# EAGLE design trill-hex (EAGLE 6.5.0)
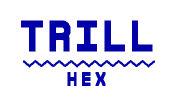
[diagram p0: schematic, sheet 1, part 1 of 2]
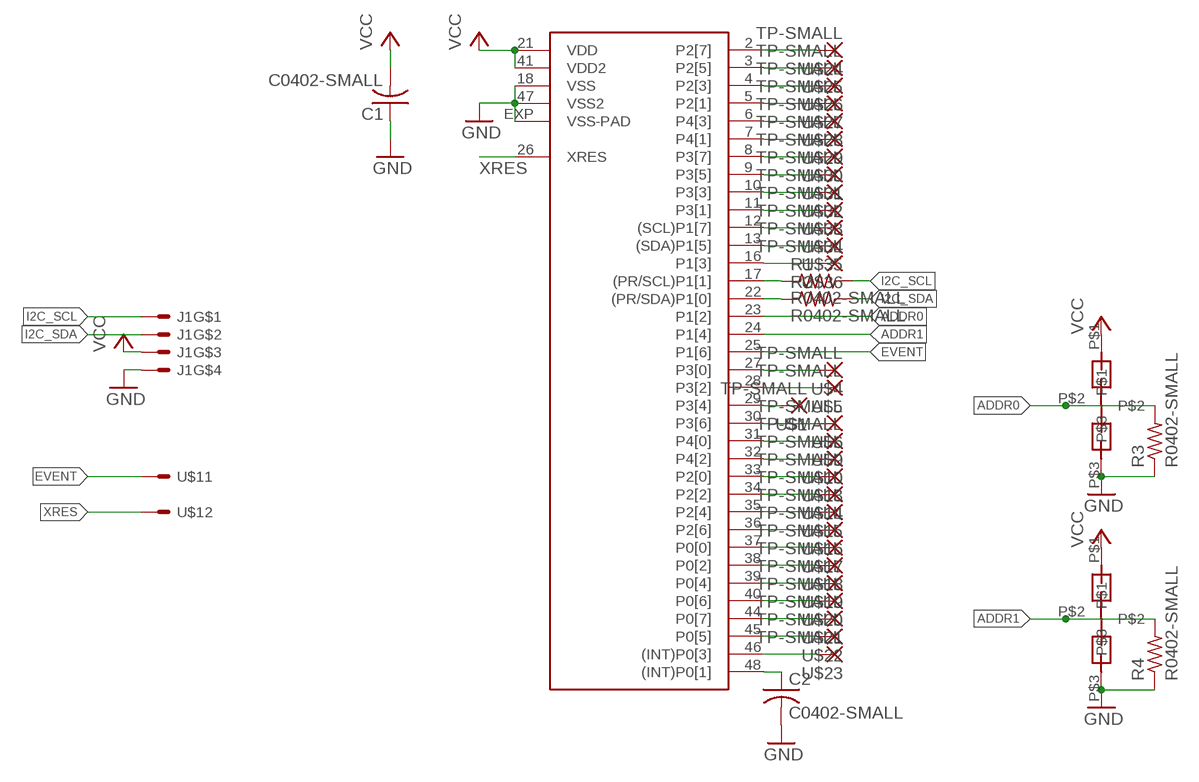
[diagram p1: schematic, sheet 1, part 2 of 2]

## Parts
C1  C0402-SMALL  [C0402-SMALL]
C2  C0402-SMALL  [C0402-SMALL]
IC1  CY8C206X6A  [QFN48-LEADS]
J1  GROVE-SMT  [JST-PH-4-SMT]
R1  R0402-SMALL  [C0402-SMALL]
R2  R0402-SMALL  [C0402-SMALL]
R3  R0402-SMALL  [C0402-SMALL]
R4  R0402-SMALL  [C0402-SMALL]
U$1  TP-SMALL  [TESTPAD-SMALL]
U$4  TP-SMALL  [TESTPAD-SMALL]
U$5  TP-SMALL  [TESTPAD-SMALL]
U$6  TP-SMALL  [TESTPAD-SMALL]
U$7  SOLDER_JUMPER_3PAD  [SOLDER_JUMPER_3PAD]
U$8  SOLDER_JUMPER_3PAD  [SOLDER_JUMPER_3PAD]
U$9  TP-SMALL  [TESTPAD-SMALL]
U$10  TP-SMALL  [TESTPAD-SMALL]
U$11  JST-SMT-EXTRAPAD  [JST-SMT-EXTRAPAD]
U$12  JST-SMT-EXTRAPAD  [JST-SMT-EXTRAPAD]
U$13  TP-SMALL  [TESTPAD-SMALL]
U$14  TP-SMALL  [TESTPAD-SMALL]
U$15  TP-SMALL  [TESTPAD-SMALL]
U$16  TP-SMALL  [TESTPAD-SMALL]
U$17  TP-SMALL  [TESTPAD-SMALL]
U$18  TP-SMALL  [TESTPAD-SMALL]
U$19  TP-SMALL  [TESTPAD-SMALL]
U$20  TP-SMALL  [TESTPAD-SMALL]
U$21  TP-SMALL  [TESTPAD-SMALL]
U$22  TP-SMALL  [TESTPAD-SMALL]
U$23  TP-SMALL  [TESTPAD-SMALL]
U$24  TP-SMALL  [TESTPAD-SMALL]
U$25  TP-SMALL  [TESTPAD-SMALL]
U$26  TP-SMALL  [TESTPAD-SMALL]
U$27  TP-SMALL  [TESTPAD-SMALL]
U$28  TP-SMALL  [TESTPAD-SMALL]
U$29  TP-SMALL  [TESTPAD-SMALL]
U$30  TP-SMALL  [TESTPAD-SMALL]
U$31  TP-SMALL  [TESTPAD-SMALL]
U$32  TP-SMALL  [TESTPAD-SMALL]
U$33  TP-SMALL  [TESTPAD-SMALL]
U$34  TP-SMALL  [TESTPAD-SMALL]
U$35  TP-SMALL  [TESTPAD-SMALL]
U$36  TP-SMALL  [TESTPAD-SMALL]

## Nets
ADDR0: IC1.23(P1[2]) R3.P$2 U$7.P$2
ADDR1: IC1.24(P1[4]) R4.P$2 U$8.P$2
COL1: IC1.27(P3[0]) U$4.P$1(P)
COL2: IC1.28(P3[2]) U$5.P$1(P)
COL3: IC1.29(P3[4]) U$1.P$1(P)
COL4: IC1.30(P3[6]) U$6.P$1(P)
COL5: IC1.31(P4[0]) U$9.P$1(P)
COL6: IC1.32(P4[2]) U$10.P$1(P)
COL7: IC1.33(P2[0]) U$13.P$1(P)
COL8: IC1.13((SDA)P1[5]) U$35.P$1(P)
COL9: IC1.44(P0[7]) U$21.P$1(P)
COL10: IC1.45(P0[5]) U$22.P$1(P)
COL11: IC1.3(P2[5]) U$25.P$1(P)
COL12: IC1.4(P2[3]) U$26.P$1(P)
COL13: IC1.5(P2[1]) U$27.P$1(P)
COL14: IC1.6(P4[3]) U$28.P$1(P)
EVENT: IC1.25(P1[6]) U$11.P$1(S)
GND: C1.P$1 C2.P$2 IC1.18(VSS) IC1.47(VSS2) IC1.EXP(VSS-PAD) J1.4 R3.P$1 R4.P$1 U$7.P$3 U$8.P$3
I2C_SCL: J1.1 R1.P$2
I2C_SDA: J1.2 R2.P$2
N$3: C2.P$1 IC1.48((INT)P0[1])
N$71Z1Z1O1K1: IC1.17((PR/SCL)P1[1]) R1.P$1
N$72Z1Z1O1K1: IC1.22((PR/SDA)P1[0]) R2.P$1
ROW1: IC1.16(P1[3]) U$36.P$1(P)
ROW2: IC1.12((SCL)P1[7]) U$34.P$1(P)
ROW3: IC1.11(P3[1]) U$33.P$1(P)
ROW4: IC1.10(P3[3]) U$32.P$1(P)
ROW5: IC1.9(P3[5]) U$31.P$1(P)
ROW6: IC1.8(P3[7]) U$30.P$1(P)
ROW7: IC1.7(P4[1]) U$29.P$1(P)
ROW8: IC1.2(P2[7]) U$24.P$1(P)
ROW9: IC1.46((INT)P0[3]) U$23.P$1(P)
ROW10: IC1.34(P2[2]) U$14.P$1(P)
ROW11: IC1.35(P2[4]) U$15.P$1(P)
ROW12: IC1.36(P2[6]) U$16.P$1(P)
ROW13: IC1.37(P0[0]) U$17.P$1(P)
ROW14: IC1.38(P0[2]) U$18.P$1(P)
ROW15: IC1.39(P0[4]) U$19.P$1(P)
ROW16: IC1.40(P0[6]) U$20.P$1(P)
VCC: C1.P$2 IC1.21(VDD) IC1.41(VDD2) J1.3 U$7.P$1 U$8.P$1
XRES: IC1.26(XRES) U$12.P$1(S)

## Notes on the sheet
- /Users/apm/Documents/eagle/trill-private/logos/trill_hex_logo.bmp

## Library data of the parts
C1 C2 = custom:C0402-SMALL
IC1 = custom:CY8C206X6A
J1 = custom:GROVE-SMT
R1-R4 = custom:R0402-SMALL
U$1 U$4-U$6 U$9 U$10 U$13-U$36 = custom:TP-SMALL
U$7 U$8 = custom:SOLDER_JUMPER_3PAD
U$11 U$12 = custom:JST-SMT-EXTRAPAD

## Board
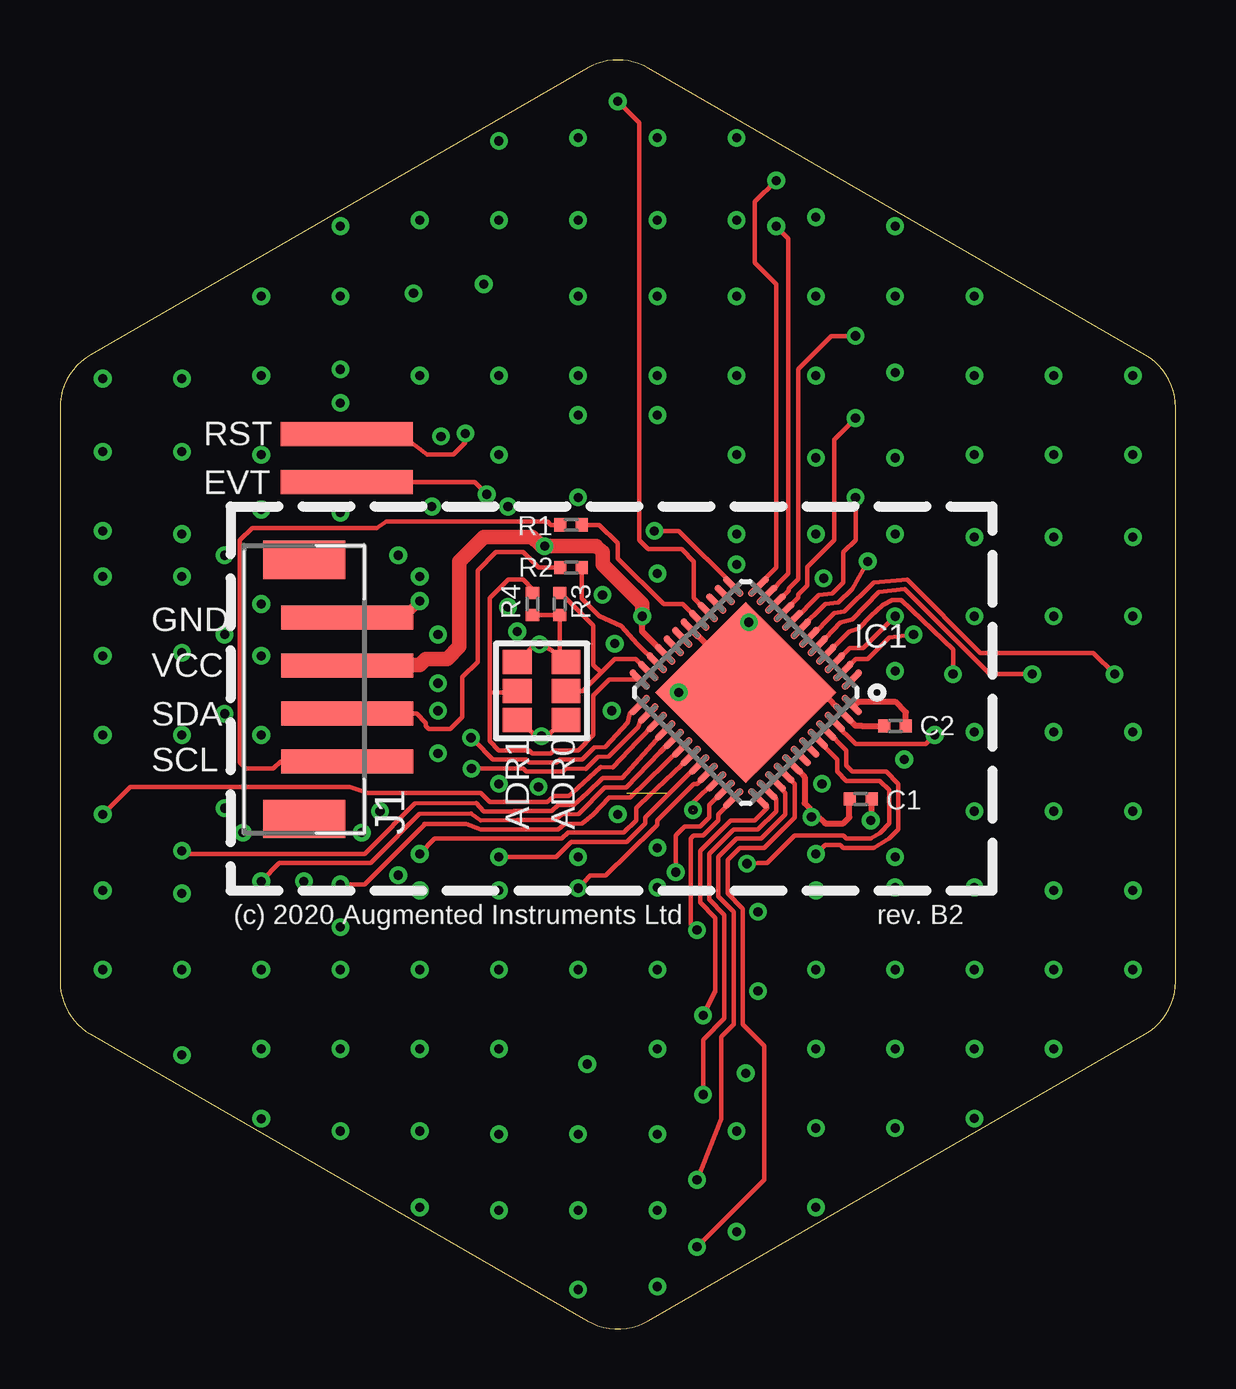
[diagram p2: board, top side]
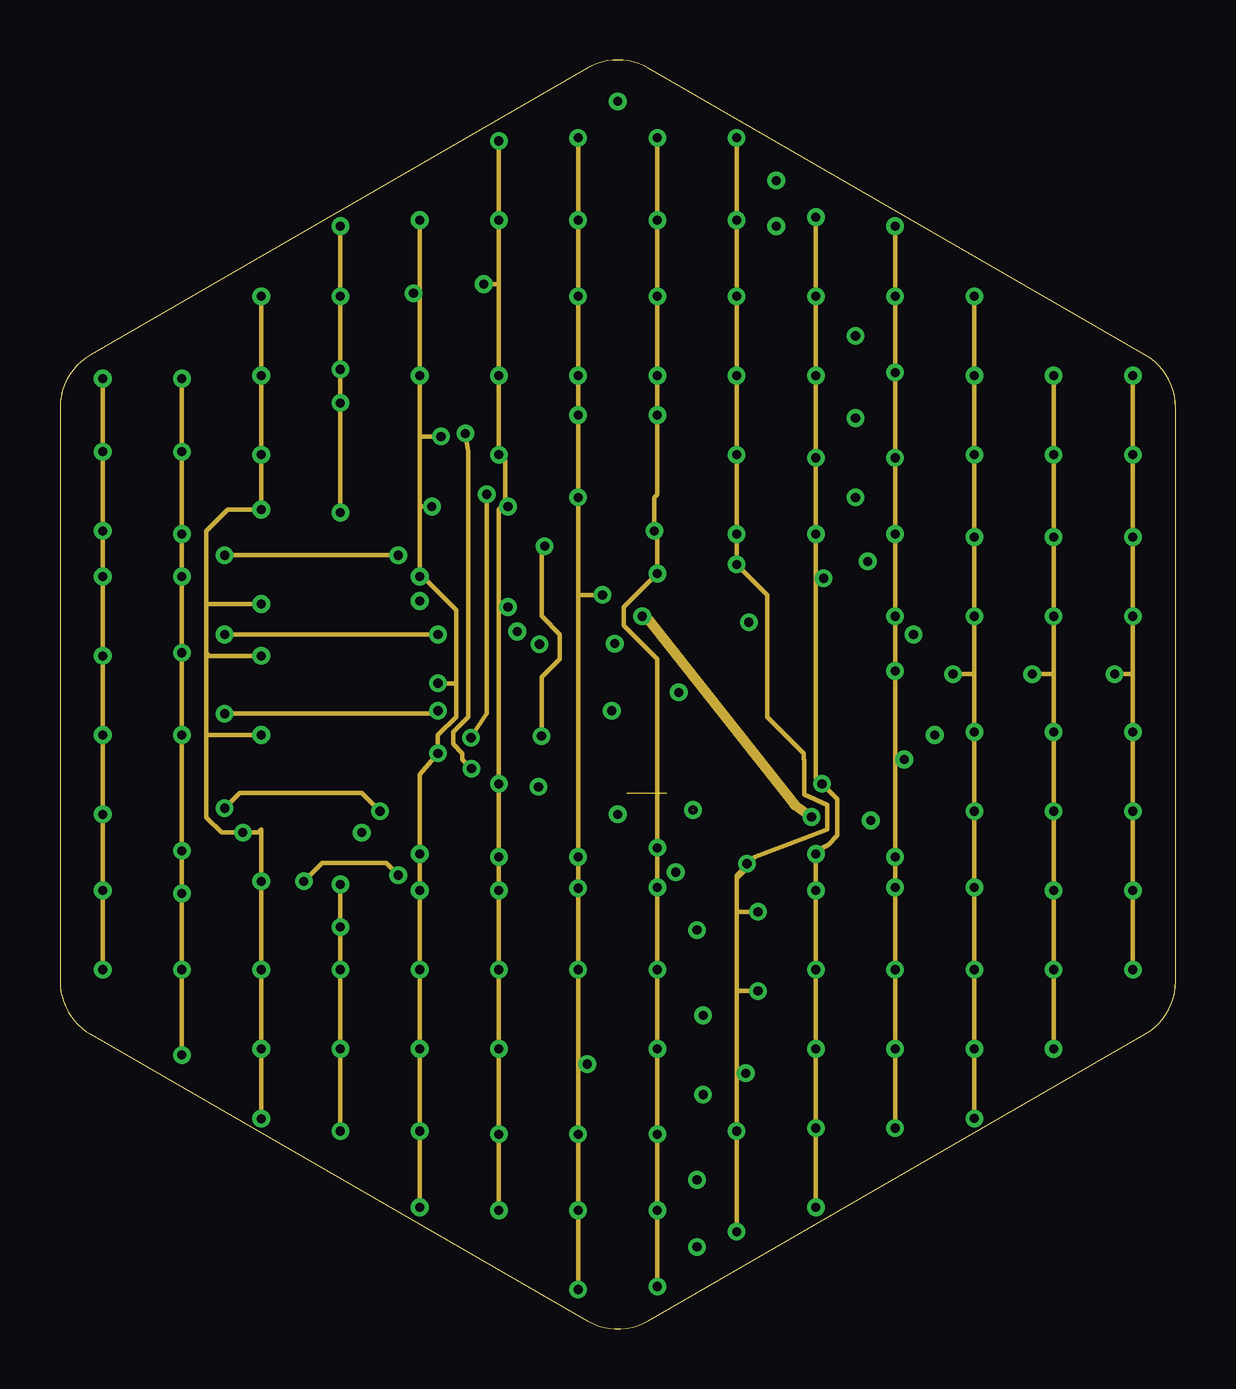
[diagram p3: board, inner layer Route2]
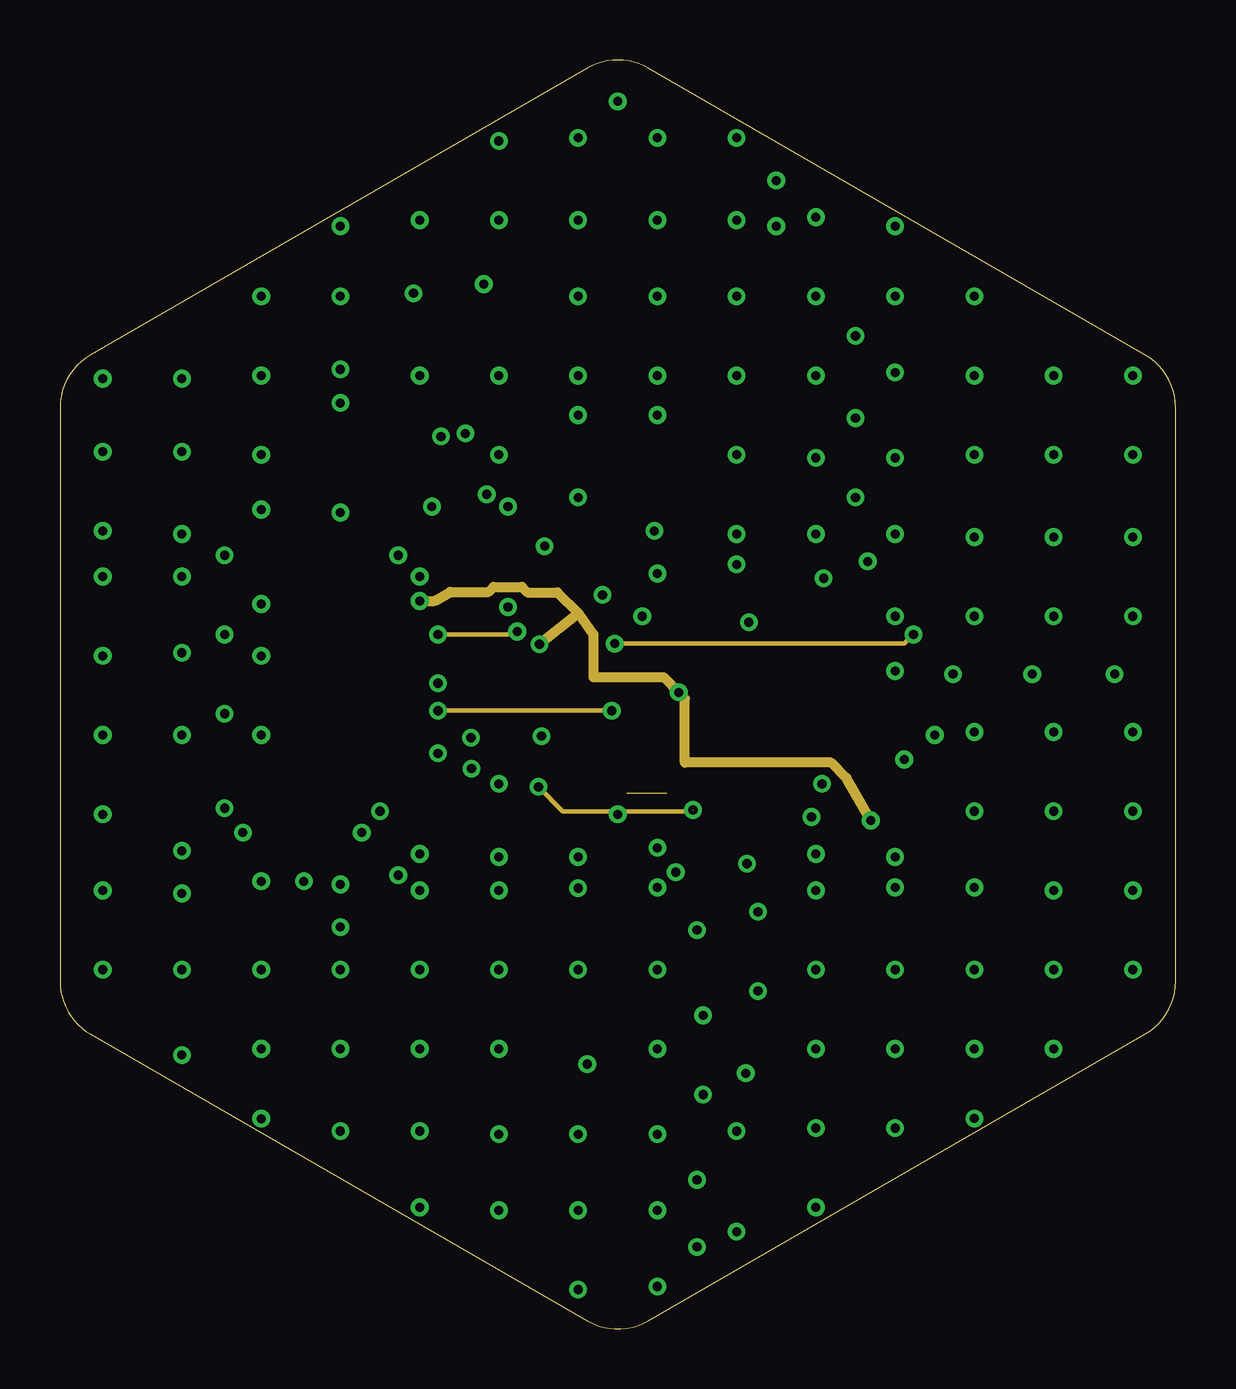
[diagram p4: board, inner layer Route3]
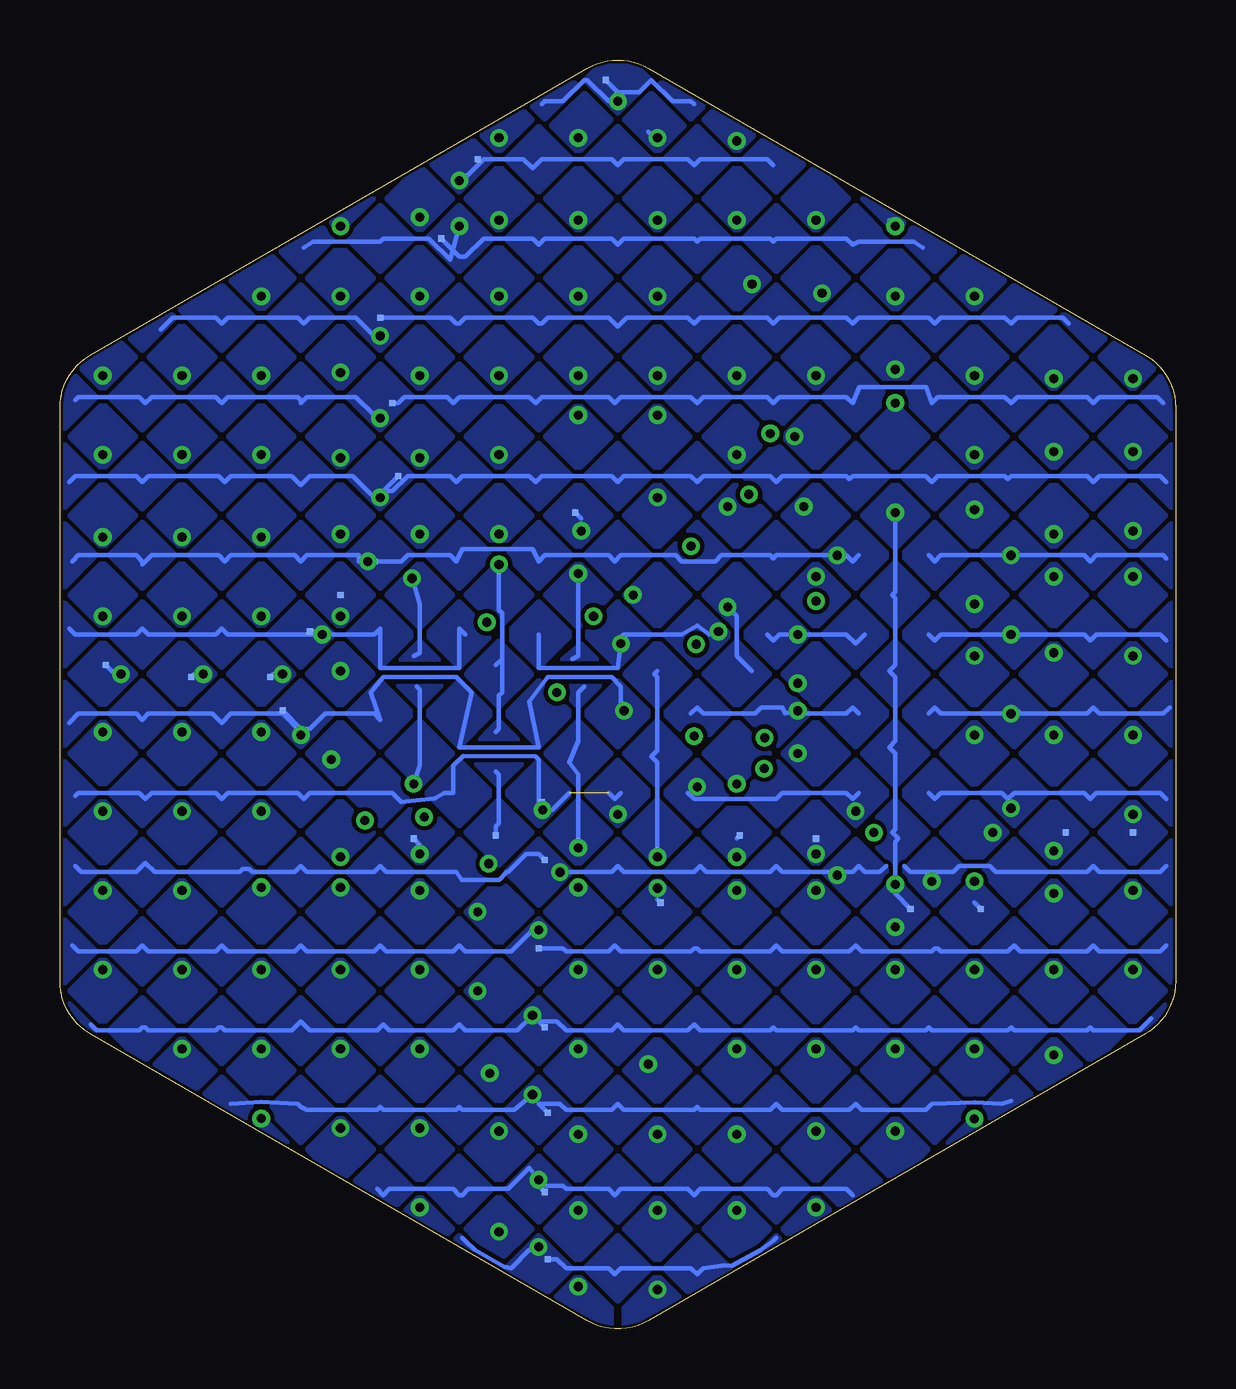
[diagram p5: board, bottom side, seen from below]

Size 46.48 x 52.89 mm. Coordinates in mm from the lower left corner, seen from the top.
Outline: 0,38.39 0,14.49 arc60 1.27,12.29 21.97,0.34 arc60 24.51,0.34 45.22,12.29 arc60 46.48,14.49 46.48,38.39 arc60 45.22,40.59 24.51,52.55 arc60 21.97,52.55 1.27,40.59 arc60 0,38.39
Copper layers (1*2*3*16): Top 0.035mm / dielectric 0.2mm / Route2 0.035mm / dielectric 1.1mm / Route3 0.035mm / dielectric 0.2mm / Bottom 0.035mm
Design rules "default *": minimum track width 7mil, minimum drill 15mil, track to track 7mil, track to pad 7mil, pad to pad 7mil, via to via 7mil, smd to smd 0mil, copper to edge 5mil, drill to drill 7mil, minimum pad ring 7mil, minimum via ring 7mil, stop-mask expansion 4mil, vias tented up to drill 20mil, thermal gap 10mil

### Footprints (pad centres in the part's own frame; a part is rotated, then mirrored left to right if it is on the bottom)
C0402-SMALL = smd 0.5 x 0.55: P$1 -0.45,0; P$2 0.45,0
QFN48-LEADS = smd 1.1 x 0.3: 1 -3.5,2.75; 2 -3.5,2.25; 3 -3.5,1.75; 4 -3.5,1.25; 5 -3.5,0.75; 6 -3.5,0.25; 7 -3.5,-0.25; 8 -3.5,-0.75; 9 -3.5,-1.25; 10 -3.5,-1.75; 11 -3.5,-2.25; 12 -3.5,-2.75; 25 3.5,-2.75; 26 3.5,-2.25; 27 3.5,-1.75; 28 3.5,-1.25; 29 3.5,-0.75; 30 3.5,-0.25; 31 3.5,0.25; 32 3.5,0.75; 33 3.5,1.25; 34 3.5,1.75; 35 3.5,2.25; 36 3.5,2.75 | smd 0.3 x 1.1: 13 -2.75,-3.5; 14 -2.25,-3.5; 15 -1.75,-3.5; 16 -1.25,-3.5; 17 -0.75,-3.5; 18 -0.25,-3.5; 19 0.25,-3.5; 20 0.75,-3.5; 21 1.25,-3.5; 22 1.75,-3.5; 23 2.25,-3.5; 24 2.75,-3.5; 37 2.75,3.5; 38 2.25,3.5; 39 1.75,3.5; 40 1.25,3.5; 41 0.75,3.5; 42 0.25,3.5; 43 -0.25,3.5; 44 -0.75,3.5; 45 -1.25,3.5; 46 -1.75,3.5; 47 -2.25,3.5; 48 -2.75,3.5 | smd 5.33 x 5.33: EXP 0,0
JST-PH-4-SMT = smd 1 x 5.5: 1 -3,-0.8; 2 -1,-0.8; 3 1,-0.8; 4 3,-0.8 | smd 1.6 x 3.4: NC1 -5.4,1; NC2 5.4,1
TESTPAD-SMALL = smd 0.254 x 0.254: P$1 0,0
SOLDER_JUMPER_3PAD = smd 1 x 1.2: P$1 0,0; P$2 1.2,0; P$3 2.4,0
JST-SMT-EXTRAPAD = smd 1 x 5.5: P$1 0,0

### Placement (x,y rotation side)
C1  33.36,22.08 180 top
C2  34.8,25.13 180 top
IC1  28.57,26.53 225 top
J1  11.18,26.66 90 top
R1  21.3,33.51 180 top
R2  21.3,31.74 180 top
R3  20.83,30.21 90 top
R4  19.69,30.21 90 top
U$1  8.13,17.51 0 bottom
U$4  1.78,20.69 0 bottom
U$5  4.57,20.69 0 bottom
U$6  11.05,17.51 0 bottom
U$7  21.08,25.39 90 top
U$8  19.05,25.39 90 top
U$9  14.99,20.43 0 bottom
U$10  18.16,20.56 0 bottom
U$11  11.94,35.29 90 top
U$12  11.94,37.29 90 top
U$13  21.46,17.77 0 bottom
U$14  26.42,21.96 0 bottom
U$15  26.29,19.54 0 bottom
U$16  26.54,15.86 0 bottom
U$17  26.29,12.56 0 bottom
U$18  26.16,9 0 bottom
U$19  26.29,5.7 0 bottom
U$20  26.16,2.91 0 bottom
U$21  28.32,20.56 0 bottom
U$22  31.75,20.43 0 bottom
U$23  37.21,25.77 0 bottom
U$24  36.07,29.07 0 bottom
U$25  34.8,30.59 0 bottom
U$26  37.72,27.16 0 bottom
U$27  41.02,27.16 0 bottom
U$28  44.58,27.67 0 bottom
U$29  33.4,31.99 0 bottom
U$30  32.39,35.55 0 bottom
U$31  32.64,38.59 0 bottom
U$32  33.15,42.15 0 bottom
U$33  30.61,45.45 0 bottom
U$34  29.08,48.75 0 bottom
U$35  25.02,34.02 0 bottom
U$36  23.75,52.06 0 bottom

### Tracks (layer width: path | path; a pad name or v marks a point on that pad's centre or on a via)
ADDR0
  Top 0.178: U$7.P$2 21.77,26.59 22.54,27.35 | 22.54,27.35 23.11,27.93 24,27.93 IC1.23 | R3.P$2 21.14,30.41 22.23,29.32 22.23,27.67 22.54,27.35
ADDR1
  Top 0.178: IC1.24 22.88,27.06 22.23,26.4 22.23,24.75 21.59,24.12 20.57,24.12 20.45,23.99 19.69,23.99 19.56,24.12 18.29,24.12 17.91,24.5 17.91,26.53 | 17.91,26.53 18.99,26.53 U$8.P$2 | R4.P$2 19.69,30.85 19.3,31.23 18.67,31.23 17.91,30.47 17.91,26.53
COL1  (via drill 0.38)
  Top 0.178: 24.85,25.29 24.05,24.49 23.03,23.4 22.54,23.43 21.34,22.34 21.19,22.21 20.59,22.21 20.31,21.96 17.91,21.96 17.53,22.34 12.83,22.34 12.06,22.59 2.92,22.59 v1.78,21.45
  Top 0.203: IC1.27 24.85,25.29
  Route2 0.178: 1.78,39.86 v1.78,39.61 v1.78,36.56 v1.78,33.26 v1.78,31.35 v1.78,28.05 v1.78,24.75 v1.78,21.45 v1.78,18.27 v1.78,14.97
  Bottom 0.178: v1.78,14.97 1.78,14.84 1.91,14.72
  pour Bottom: 1.78,12.69 3.17,14.08 1.78,15.48 0.38,14.08
  pour Bottom: 1.78,15.99 3.17,17.38 1.78,18.78 0.38,17.38
  pour Bottom: 1.78,22.59 3.17,23.99 1.78,25.39 0.38,23.99
  pour Bottom: 1.78,25.89 3.17,27.29 1.78,28.69 0.38,27.29
  pour Bottom: 1.78,29.2 3.17,30.59 1.78,31.99 0.38,30.59
  pour Bottom: 1.78,32.5 3.17,33.89 1.78,35.29 0.38,33.89
  pour Bottom: 1.78,35.8 3.17,37.2 1.78,38.59 0.38,37.2
  pour Bottom: 1.78,39.1 3.17,40.5 1.78,41.9 0.38,40.5
  pour Bottom: 1.78,19.29 3.17,20.69 1.78,22.08 0.38,20.69
COL2  (via drill 0.38)
  Top 0.178: IC1.28 23.42,22.97 22.61,22.97 21.97,22.34 21.4,21.83 20.77,21.84 20.48,21.6 18.91,21.58 18.92,21.58 17.65,21.58 17.33,21.91 14.79,21.91 12.94,20.05 12.94,20.04 12.7,19.8 5.21,19.8 v5.08,19.92
  Top 0.203: IC1.28
  Route2 0.178: v5.08,11.42 v5.08,14.97 v5.08,18.15 v5.08,19.92 v5.08,24.75 v5.08,28.18 v5.08,31.35 v5.08,33.13 v5.08,36.56 v5.08,39.61
  Bottom 0.178: v5.08,39.61 5.21,39.74
  pour Bottom: 5.08,9.38 6.48,10.78 5.08,12.18 3.68,10.78
  pour Bottom: 5.08,12.69 6.48,14.08 5.08,15.48 3.68,14.08
  pour Bottom: 5.08,15.99 6.48,17.38 5.08,18.78 3.68,17.38
  pour Bottom: 5.08,19.29 6.48,20.69 5.08,22.08 3.68,20.69
  pour Bottom: 5.08,22.59 6.48,23.99 5.08,25.39 3.68,23.99
  pour Bottom: 5.08,25.89 6.48,27.29 5.08,28.69 3.68,27.29
  pour Bottom: 5.08,29.2 6.48,30.59 5.08,31.99 3.68,30.59
  pour Bottom: 5.08,32.5 6.48,33.89 5.08,35.29 3.68,33.89
  pour Bottom: 5.08,35.8 6.48,37.2 5.08,38.59 3.68,37.2
  pour Bottom: 5.08,39.1 6.48,40.5 5.08,41.9 3.68,40.5
COL3  (via drill 0.38)
  Top 0.178: 24.99,24.02 23.59,22.56 22.84,22.56 22.7,22.56 21.62,21.46 20.9,21.44 20.64,21.21 19.2,21.21 19.05,21.21 17.53,21.19 17.12,21.48 17.15,21.48 14.97,21.46 13.19,19.67 13.21,19.67 12.95,19.42 9.14,19.42 v8.38,18.65
  Top 0.203: IC1.29 25.56,24.58 24.99,24.02
  Route2 0.178: v8.38,18.65 v8.38,14.97 | v8.39,8.76 v8.38,11.67 v8.38,14.97 | v8.38,14.97 8.38,20.81 8.26,20.69 v7.62,20.69 6.73,20.69 6.1,21.32 6.1,24.75 | v8.38,43.04 v8.38,39.74 v8.38,36.43 v8.38,34.15 6.98,34.15 6.1,33.26 6.1,30.21 | 6.1,30.21 v8.38,30.21 | 6.1,24.75 6.1,28.18 | v8.38,28.05 6.22,28.05 6.1,28.18 | v8.38,24.75 6.1,24.75 | 6.1,30.21 6.1,28.18
  Bottom 0.178: 8.38,17.77 U$1.P$1 | 8.38,8.62 8.51,8.49
  pour Bottom: 8.38,42.4 9.78,43.8 8.38,45.2 6.98,43.8
  pour Bottom: 8.38,39.1 9.78,40.5 8.38,41.9 6.98,40.5
  pour Bottom: 8.38,35.8 9.78,37.2 8.38,38.59 6.98,37.2
  pour Bottom: 8.38,32.5 9.78,33.89 8.38,35.29 6.98,33.89
  pour Bottom: 8.38,29.2 9.78,30.59 8.38,31.99 6.98,30.59
  pour Bottom: 8.38,25.89 9.78,27.29 8.38,28.69 6.98,27.29
  pour Bottom: 8.38,22.59 9.78,23.99 8.38,25.39 6.98,23.99
  pour Bottom: 8.38,19.29 9.78,20.69 8.38,22.08 6.98,20.69
  pour Bottom: 8.38,15.99 9.78,17.38 8.38,18.78 6.98,17.38
  pour Bottom: 8.38,12.69 9.78,14.08 8.38,15.48 6.98,14.08
  pour Bottom: 8.38,9.38 9.78,10.78 8.38,12.18 6.98,10.78
  pour Bottom: 8.38,6.08 9.78,7.48 8.38,8.88 6.98,7.48
COL4  (via drill 0.38)
  Top 0.178: 25.9,24.23 23.77,22.14 22.88,22.14 22.23,21.45 21.75,21.06 21.02,21.05 20.76,20.82 19.4,20.82 19.3,20.81 17.53,20.81 16.92,21.04 15.19,21.04 15.19,21.01 12.7,18.53 v11.68,18.53
  Top 0.203: IC1.30 25.9,24.23
  Route2 0.178: v11.68,18.53 v11.68,16.75 v11.68,14.97 v11.68,11.67 v11.68,8.24 | v11.68,34.02 v11.68,38.59 v11.68,39.99 v11.68,43.04 v11.68,45.96
  Bottom 0.178: 11.68,18.15 U$6.P$1 | v11.68,45.96 11.94,46.21 | v11.68,34.02 11.68,30.72 11.81,30.59 11.68,30.47 11.68,27.67 11.94,27.42 11.68,27.16 11.68,24.5 11.94,24.24 11.68,23.99 11.68,20.81 11.81,20.69 11.56,20.43 11.68,20.31 v11.68,18.53
  pour Bottom: 11.68,6.08 13.08,7.48 11.68,8.88 10.29,7.48
  pour Bottom: 11.68,9.38 13.08,10.78 11.68,12.18 10.29,10.78
  pour Bottom: 11.68,12.69 13.08,14.08 11.68,15.48 10.29,14.08
  pour Bottom: 11.68,15.99 13.08,17.38 11.68,18.78 10.29,17.38
  pour Bottom: 11.68,19.29 13.08,20.69 11.68,22.08 10.29,20.69
  pour Bottom: 11.68,22.59 13.08,23.99 11.68,25.39 10.29,23.99
  pour Bottom: 11.68,25.89 13.08,27.29 11.68,28.69 10.29,27.29
  pour Bottom: 11.68,29.2 13.08,30.59 11.68,31.99 10.29,30.59
  pour Bottom: 11.68,32.5 13.08,33.89 11.68,35.29 10.29,33.89
  pour Bottom: 11.68,35.8 13.08,37.2 11.68,38.59 10.29,37.2
  pour Bottom: 11.68,39.1 13.08,40.5 11.68,41.9 10.29,40.5
  pour Bottom: 11.68,42.4 13.08,43.8 11.68,45.2 10.29,43.8
  pour Bottom: 11.68,45.71 13.08,47.1 11.68,48.5 10.29,47.1
COL5  (via drill 0.38)
  Top 0.178: IC1.31 26.28,23.85 24.13,21.83 24,21.7 24,21.19 23.49,20.68 23.46,20.68 21.17,20.69 20.91,20.43 19.54,20.43 19.44,20.43 15.62,20.43 v14.99,19.8
  Route2 0.178: v14.99,19.8 v14.99,18.27 | v14.99,5.07 v14.99,8.24 v14.99,11.67 v14.99,14.97 v14.99,18.27 | v14.99,18.27 14.99,23.1 v15.75,23.99 15.75,24.75 16.51,25.51 16.51,26.91 | 14.99,34.28 v14.99,31.35 15.11,31.35 16.51,29.96 16.51,26.91 | 14.99,34.28 14.99,37.2 | 14.99,37.2 v14.99,39.74 14.99,43.17 | v14.73,43.17 14.99,43.17 | 14.99,43.17 v14.99,46.21 | v15.88,37.2 14.99,37.2 | v15.49,34.28 14.99,34.28 | v15.75,26.91 16.51,26.91
  Bottom 0.178: v14.99,46.21 15.11,46.34
  pour Bottom: 14.99,45.71 16.38,47.1 14.99,48.5 13.59,47.1
  pour Bottom: 14.99,42.4 16.38,43.8 14.99,45.2 13.59,43.8
  pour Bottom: 14.99,39.1 16.38,40.5 14.99,41.9 13.59,40.5
  pour Bottom: 14.99,35.8 16.38,37.2 14.99,38.59 13.59,37.2
  pour Bottom: 14.99,32.5 16.38,33.89 14.99,35.29 13.59,33.89
  pour Bottom: 14.99,29.2 16.38,30.59 14.99,31.99 13.59,30.59
  pour Bottom: 14.99,25.89 16.38,27.29 14.99,28.69 13.59,27.29
  pour Bottom: 14.99,22.59 16.38,23.99 14.99,25.39 13.59,23.99
  pour Bottom: 14.99,19.29 16.38,20.69 14.99,22.08 13.59,20.69
  pour Bottom: 14.99,15.99 16.38,17.38 14.99,18.78 13.59,17.38
  pour Bottom: 14.99,12.69 16.38,14.08 14.99,15.48 13.59,14.08
  pour Bottom: 14.99,9.38 16.38,10.78 14.99,12.18 13.59,10.78
  pour Bottom: 14.99,6.08 16.38,7.48 14.99,8.88 13.59,7.48
  pour Bottom: 14.99,2.78 16.38,4.18 14.99,5.57 13.59,4.18
COL6  (via drill 0.38)
  Top 0.178: IC1.32 26.59,23.52 24.38,21.32 24.38,21.07 23.62,20.31 21.31,20.31 20.67,19.67 v18.29,19.67
  Route2 0.178: v18.29,4.94 v18.29,8.11 v18.29,11.67 v18.29,14.97 v18.29,18.27 v18.29,19.67 v18.29,22.72 18.29,30.08 | 18.29,30.08 18.29,34.15 18.54,34.4 | 18.54,34.4 18.54,36.18 v18.29,36.43 v18.29,39.74 18.29,43.55 | v17.65,43.55 18.29,43.55 | 18.29,43.55 v18.29,46.21 v18.29,49.52 | 18.54,34.4 v18.67,34.28 | v18.67,30.08 18.29,30.08
  Bottom 0.178: 18.29,20.43 U$10.P$1 | v18.29,49.52 18.41,49.52 | v18.67,30.08 18.29,29.7 18.29,28.05 17.65,27.42
  pour Bottom: 18.29,2.78 19.69,4.18 18.29,5.57 16.89,4.18
  pour Bottom: 18.29,6.08 19.69,7.48 18.29,8.88 16.89,7.48
  pour Bottom: 18.29,9.38 19.69,10.78 18.29,12.18 16.89,10.78
  pour Bottom: 18.29,12.69 19.69,14.08 18.29,15.48 16.89,14.08
  pour Bottom: 18.29,15.99 19.69,17.38 18.29,18.78 16.89,17.38
  pour Bottom: 18.29,19.29 19.69,20.69 18.29,22.08 16.89,20.69
  pour Bottom: 18.29,22.59 19.69,23.99 18.29,25.39 16.89,23.99
  pour Bottom: 18.29,25.89 19.69,27.29 18.29,28.69 16.89,27.29
  pour Bottom: 18.29,29.2 19.69,30.59 18.29,31.99 16.89,30.59
  pour Bottom: 18.29,32.5 19.69,33.89 18.29,35.29 16.89,33.89
  pour Bottom: 18.29,35.8 19.69,37.2 18.29,38.59 16.89,37.2
  pour Bottom: 18.29,39.1 19.69,40.5 18.29,41.9 16.89,40.5
  pour Bottom: 18.29,42.4 19.69,43.8 18.29,45.2 16.89,43.8
  pour Bottom: 18.29,45.71 19.69,47.1 18.29,48.5 16.89,47.1
  pour Bottom: 18.29,49.01 19.69,50.4 18.29,51.8 16.89,50.4
COL7  (via drill 0.38)
  Top 0.178: IC1.33 26.54,22.72 26.42,22.72 24.89,21.19 24.89,21 24.74,20.85 22.73,18.91 22.1,18.91 v21.59,18.37
  Route2 0.178: 21.59,11.03 v21.59,14.97 v21.59,18.37 v21.59,19.67 21.59,30.59 | v21.97,11.03 21.59,11.03 | 21.59,11.03 v21.59,8.11 v21.59,4.94 v21.59,1.64 | 21.59,30.59 v21.59,34.66 v21.59,38.09 v21.59,39.74 v21.59,43.04 v21.59,46.21 v21.59,49.64 | v22.61,30.59 21.59,30.59
  Bottom 0.178: 21.59,17.89 U$13.P$1 | v21.59,49.64 21.72,49.64 21.97,49.9 | v21.59,19.67 21.59,23.61 21.84,23.86 21.59,24.12 21.59,27.16 21.72,27.29 21.59,27.42
  pour Bottom: 22.99,-0.65 22.99,0.87 21.59,2.27 20.19,0.87
  pour Bottom: 21.59,2.78 22.99,4.18 21.59,5.57 20.19,4.18
  pour Bottom: 21.59,6.08 22.99,7.48 21.59,8.88 20.19,7.48
  pour Bottom: 21.59,9.38 22.99,10.78 21.59,12.18 20.19,10.78
  pour Bottom: 21.59,12.69 22.99,14.08 21.59,15.48 20.19,14.08
  pour Bottom: 21.59,15.99 22.99,17.38 21.59,18.78 20.19,17.38
  pour Bottom: 21.59,19.29 22.99,20.69 21.59,22.08 20.19,20.69
  pour Bottom: 21.59,22.59 22.99,23.99 21.59,25.39 20.19,23.99
  pour Bottom: 21.59,25.89 22.99,27.29 21.59,28.69 20.19,27.29
  pour Bottom: 21.59,29.2 22.99,30.59 21.59,31.99 20.19,30.59
  pour Bottom: 21.59,32.5 22.99,33.89 21.59,35.29 20.19,33.89
  pour Bottom: 21.59,35.8 22.99,37.2 21.59,38.59 20.19,37.2
  pour Bottom: 21.59,39.1 22.99,40.5 21.59,41.9 20.19,40.5
  pour Bottom: 21.59,42.4 22.99,43.8 21.59,45.2 20.19,43.8
  pour Bottom: 21.59,45.71 22.99,47.1 21.59,48.5 20.19,47.1
  pour Bottom: 21.59,49.01 22.99,50.4 21.84,51.55 20.45,50.15
COL8  (via drill 0.38)
  Top 0.178: IC1.13 28.05,31 25.78,33.26 v24.77,33.26
  Route2 0.178: v24.89,1.76 v24.89,4.94 v24.89,8.11 v24.89,11.67 v24.89,14.97 v24.89,18.4 v24.89,20.05 24.89,27.93 23.49,29.32 23.49,30.08 v24.89,31.48 24.89,33.13 v24.77,33.26 24.77,34.66 24.89,34.78 v24.89,38.09 v24.89,39.74 v24.89,43.04 v24.89,46.21 v24.89,49.64
  Bottom 0.178: 24.77,33.77 U$35.P$1 | v24.89,1.76 25.02,1.64 | v24.89,20.05 24.89,23.1 25.27,23.61 24.89,24.5 24.89,26.53 24.64,26.78 | v24.89,31.48 24.89,28.05 25.15,27.93
  pour Bottom: 24.89,49.01 26.04,50.15 24.64,51.55 23.49,50.4
  pour Bottom: 24.89,45.71 26.29,47.1 24.89,48.5 23.49,47.1
  pour Bottom: 24.89,42.4 26.29,43.8 24.89,45.2 23.49,43.8
  pour Bottom: 24.89,39.1 26.29,40.5 24.89,41.9 23.49,40.5
  pour Bottom: 24.89,35.8 26.29,37.2 24.89,38.59 23.49,37.2
  pour Bottom: 24.89,32.5 26.29,33.89 24.89,35.29 23.49,33.89
  pour Bottom: 24.89,29.2 26.29,30.59 24.89,31.99 23.49,30.59
  pour Bottom: 24.89,25.89 26.29,27.29 23.49,27.29
  pour Bottom: 24.89,22.59 26.29,23.99 24.89,25.39 23.49,23.99
  pour Bottom: 24.89,19.29 26.29,20.69 24.89,22.08 23.49,20.69
  pour Bottom: 24.89,15.99 26.29,17.38 24.89,18.78 23.49,17.38
  pour Bottom: 24.89,12.69 26.29,14.08 24.89,15.48 23.49,14.08
  pour Bottom: 24.89,9.38 26.29,10.78 24.89,12.18 23.49,10.78
  pour Bottom: 24.89,6.08 26.29,7.48 24.89,8.88 23.49,7.48
  pour Bottom: 24.89,2.78 26.29,4.18 24.89,5.57 23.49,4.18
  pour Bottom: 23.49,-0.65 26.29,0.87 24.89,2.27 23.49,0.87
  pour Bottom: 24.77,28.56 26.16,27.42 23.62,27.42
COL9  (via drill 0.38)
  Top 0.178: IC1.44 31.58,24.54 32.39,23.73 32.39,23.23 32.77,22.85 34.16,22.85 34.54,22.46 34.55,21.06 34.18,20.68 33.78,20.43 32.77,20.43 32.64,20.56 30.61,20.56 29.46,19.42 29.08,19.42 v28.63,19.39
  Route2 0.178: v28.63,19.39 28.63,19.21 28.19,18.78 | 28.19,18.78 28.19,17.38 | 28.19,17.38 28.19,14.08 | v28.19,4.05 v28.19,8.24 28.19,10.65 | v28.57,10.65 28.19,10.65 | 28.19,10.65 28.19,14.08 | 28.19,18.78 28.19,18.91 28.96,19.67 30.99,20.43 31.97,20.81 31.96,21.84 31.01,22.27 31.01,23.71 30.99,23.73 30.99,23.99 29.46,25.51 29.46,30.59 v28.19,31.86 v28.19,33.13 v28.19,36.43 v28.19,39.74 v28.19,43.04 v28.19,46.21 v28.19,49.64 | v29.08,14.08 28.19,14.08 | v29.08,17.38 28.19,17.38
  Bottom 0.178: v28.19,49.64 28.45,49.64 | v28.19,31.86 28.19,29.96 28.07,29.83 28.07,26.53 28.19,26.4 28.19,25 28.32,24.88 | 28.07,27.93 28.32,27.67 | U$21.P$1 28.32,20.94 28.19,21.07 28.19,23.1 28.32,23.23
  pour Bottom: 28.19,2.78 29.59,4.18 28.19,5.57 26.8,4.18
  pour Bottom: 28.19,6.08 29.59,7.48 28.19,8.88 26.8,7.48
  pour Bottom: 28.19,9.38 29.59,10.78 28.19,12.18 26.8,10.78
  pour Bottom: 28.19,12.69 29.59,14.08 28.19,15.48 26.8,14.08
  pour Bottom: 28.19,15.99 29.59,17.38 28.19,18.78 26.8,17.38
  pour Bottom: 28.19,19.29 29.59,20.69 28.19,22.08 26.8,20.69
  pour Bottom: 28.19,22.59 29.59,23.99 26.8,23.99
  pour Bottom: 28.19,25.89 29.59,27.29 28.19,28.69 26.8,27.29
  pour Bottom: 28.19,29.2 29.59,30.59 28.19,31.99 26.8,30.59
  pour Bottom: 28.19,32.5 29.59,33.89 28.19,35.29 26.8,33.89
  pour Bottom: 28.19,35.8 29.59,37.2 28.19,38.59 26.8,37.2
  pour Bottom: 28.19,39.1 29.59,40.5 28.19,41.9 26.8,40.5
  pour Bottom: 28.19,42.4 29.59,43.8 28.19,45.2 26.8,43.8
  pour Bottom: 28.19,45.71 29.59,47.1 28.19,48.5 26.8,47.1
  pour Bottom: 28.19,49.01 29.59,50.4 28.19,51.8 26.8,50.4
  pour Bottom: 28.19,25.39 29.34,24.24 27.05,24.24
COL10  (via drill 0.38)
  Top 0.178: IC1.45 32.77,24.12 32.77,23.48 33.02,23.23 34.42,23.23 34.92,22.72 34.92,20.81 34.54,20.43 33.91,20.05 32.64,20.05 32.51,20.18 31.88,20.18 v31.5,19.8
  Route2 0.178: v31.5,5.07 v31.5,8.37 v31.5,11.67 v31.5,14.97 v31.5,18.27 v31.5,19.8 31.75,20.05 32,20.18 32.39,20.56 32.39,22.08 v31.75,22.72 31.5,22.97 31.5,31.23 | 31.5,31.23 v31.5,33.13 v31.5,36.31 v31.5,39.74 v31.5,43.04 v31.5,46.34 | v31.82,31.29 31.56,31.29 31.5,31.23
  Bottom 0.178: 31.5,20.18 U$22.P$1 | v31.5,46.34 31.75,46.34 | v31.75,22.72 31.5,23.48 31.5,26.66 31.62,26.78 | v31.82,31.29 31.5,30.21 31.5,28.18 31.75,28.05
  pour Bottom: 31.5,45.71 32.89,47.1 31.5,48.5 30.1,47.1
  pour Bottom: 31.5,42.4 32.89,43.8 31.5,45.2 30.1,43.8
  pour Bottom: 31.5,39.1 32.89,40.5 31.5,41.9 30.1,40.5
  pour Bottom: 31.5,35.8 32.89,37.2 31.5,38.59 30.1,37.2
  pour Bottom: 31.5,32.5 32.89,33.89 31.5,35.29 30.1,33.89
  pour Bottom: 31.5,29.2 32.89,30.59 31.5,31.99 30.1,30.59
  pour Bottom: 31.5,25.89 32.89,27.29 30.1,27.29
  pour Bottom: 31.5,22.59 32.89,23.99 31.5,25.39 30.1,23.99
  pour Bottom: 31.5,19.29 32.89,20.69 31.5,22.08 30.1,20.69
  pour Bottom: 31.5,15.99 32.89,17.38 31.5,18.78 30.1,17.38
  pour Bottom: 31.5,12.69 32.89,14.08 31.5,15.48 30.1,14.08
  pour Bottom: 31.5,9.38 32.89,10.78 31.5,12.18 30.1,10.78
  pour Bottom: 31.5,6.08 32.89,7.48 31.5,8.88 30.1,7.48
  pour Bottom: 31.5,2.78 32.89,4.18 31.5,5.57 30.1,4.18
  pour Bottom: 31.5,28.69 32.77,27.42 30.23,27.42
COL11  (via drill 0.38)
  Top 0.178: IC1.3 32.91,28.38 33.48,28.38 v34.8,29.7
  Route2 0.178: v34.8,45.96 v34.8,43.04 v34.8,39.86 v34.8,36.31 v34.8,33.13 v34.8,29.7 v34.8,27.42 34.8,23.73 | 34.8,23.73 v34.8,19.67 v34.8,18.4 v34.8,14.97 v34.8,11.67 v34.8,8.37 | v35.18,23.73 34.8,23.73
  Bottom 0.178: v34.8,45.96 34.67,46.09 | v34.8,8.37 34.92,8.37 35.05,8.24
  pour Bottom: 34.8,6.08 36.2,7.48 34.8,8.88 33.4,7.48
  pour Bottom: 34.8,9.38 36.2,10.78 34.8,12.18 33.4,10.78
  pour Bottom: 34.8,12.69 36.2,14.08 34.8,15.48 33.4,14.08
  pour Bottom: 34.8,15.99 36.2,17.38 34.8,18.78 33.4,17.38
  pour Bottom: 34.8,19.29 36.2,20.69 34.8,22.08 33.4,20.69
  pour Bottom: 34.8,22.59 36.2,23.99 34.8,25.39 33.4,23.99
  pour Bottom: 34.8,25.89 36.2,27.29 34.8,28.69 33.4,27.29
  pour Bottom: 34.8,29.2 36.2,30.59 34.8,31.99 33.4,30.59
  pour Bottom: 34.8,32.5 36.2,33.89 34.8,35.29 33.4,33.89
  pour Bottom: 34.8,35.8 36.2,37.2 34.8,38.59 33.4,37.2
  pour Bottom: 34.8,39.1 36.2,40.5 34.8,41.9 33.4,40.5
  pour Bottom: 34.8,42.4 36.2,43.8 34.8,45.2 33.4,43.8
  pour Bottom: 34.8,45.71 36.2,47.1 34.8,48.5 33.4,47.1
COL12  (via drill 0.38)
  Top 0.178: IC1.4 32.89,29.07 33.27,29.2 33.78,29.7 34.28,30.17 34.68,30.39 35.06,30.39 37.21,28.31 v37.21,27.29
  Route2 0.178: v37.21,27.29 38.1,27.29 | 38.1,27.29 v38.1,29.7 v38.1,33.01 v38.1,36.43 v38.1,39.74 v38.1,43.04 | 38.1,27.29 v38.1,24.88 v38.1,21.58 v38.1,18.4 v38.1,14.97 v38.1,11.67 v38.1,8.77
  Bottom 0.178: 37.59,27.29 U$26.P$1 | v38.1,8.77 38.1,8.49
  pour Bottom: 38.1,42.4 39.5,43.8 38.1,45.2 36.7,43.8
  pour Bottom: 38.1,39.1 39.5,40.5 38.1,41.9 36.7,40.5
  pour Bottom: 38.1,35.8 39.5,37.2 38.1,38.59 36.7,37.2
  pour Bottom: 38.1,32.5 39.5,33.89 38.1,35.29 36.7,33.89
  pour Bottom: 38.1,29.2 39.5,30.59 38.1,31.99 36.7,30.59
  pour Bottom: 38.1,25.89 39.5,27.29 38.1,28.69 36.7,27.29
  pour Bottom: 38.1,22.59 39.5,23.99 38.1,25.39 36.7,23.99
  pour Bottom: 38.1,19.29 39.5,20.69 38.1,22.08 36.7,20.69
  pour Bottom: 38.1,15.99 39.5,17.38 38.1,18.78 36.7,17.38
  pour Bottom: 38.1,12.69 39.5,14.08 38.1,15.48 36.7,14.08
  pour Bottom: 38.1,9.38 39.5,10.78 38.1,12.18 36.7,10.78
  pour Bottom: 38.1,6.08 39.5,7.48 38.1,8.88 36.7,7.48
COL13  (via drill 0.38)
  Top 0.178: IC1.5 31.62,28.47 32.51,29.45 33.02,29.58 34.11,30.71 35.19,30.84 38.73,27.29 v40.51,27.29
  Route2 0.178: v40.51,27.29 41.4,27.29 | 41.4,27.29 v41.4,29.7 v41.4,33.01 v41.4,36.43 v41.4,39.74 | 41.4,27.29 v41.4,24.88 v41.4,21.58 v41.4,18.27 v41.4,14.97 v41.4,11.67
  Bottom 0.178: 40.89,27.29 U$27.P$1 | v41.4,11.67 41.53,11.54
  pour Bottom: 41.4,9.38 42.8,10.78 41.4,12.18 40,10.78
  pour Bottom: 41.4,12.69 42.8,14.08 41.4,15.48 40,14.08
  pour Bottom: 41.4,15.99 42.8,17.38 41.4,18.78 40,17.38
  pour Bottom: 41.4,19.29 42.8,20.69 41.4,22.08 40,20.69
  pour Bottom: 41.4,22.59 42.8,23.99 41.4,25.39 40,23.99
  pour Bottom: 41.4,25.89 42.8,27.29 41.4,28.69 40,27.29
  pour Bottom: 41.4,29.2 42.8,30.59 41.4,31.99 40,30.59
  pour Bottom: 41.4,32.5 42.8,33.89 41.4,35.29 40,33.89
  pour Bottom: 41.4,35.8 42.8,37.2 41.4,38.59 40,37.2
  pour Bottom: 41.4,39.1 42.8,40.5 41.4,41.9 40,40.5
COL14  (via drill 0.38)
  Top 0.178: IC1.6 31.25,28.83 32.26,29.83 32.68,29.9 33.91,31.1 35.31,31.23 38.35,28.18 43.05,28.18 v43.94,27.29
  Route2 0.178: v43.94,27.29 44.7,27.29 | 44.7,27.29 v44.7,29.7 v44.7,33.01 v44.7,36.43 v44.7,39.74 | 44.7,27.29 v44.7,24.88 v44.7,21.58 v44.7,18.27 v44.7,14.97
  Bottom 0.178: 44.2,27.29 U$28.P$1 | v44.7,14.97 44.83,14.84
  pour Bottom: 44.7,39.1 46.1,40.5 44.7,41.9 43.31,40.5
  pour Bottom: 44.7,35.8 46.1,37.2 44.7,38.59 43.31,37.2
  pour Bottom: 44.7,32.5 46.1,33.89 44.7,35.29 43.31,33.89
  pour Bottom: 44.7,29.2 46.1,30.59 44.7,31.99 43.31,30.59
  pour Bottom: 44.7,25.89 46.1,27.29 44.7,28.69 43.31,27.29
  pour Bottom: 44.7,22.59 46.1,23.99 44.7,25.39 43.31,23.99
  pour Bottom: 44.7,19.29 46.1,20.69 44.7,22.08 43.31,20.69
  pour Bottom: 44.7,15.99 46.1,17.38 44.7,18.78 43.31,17.38
  pour Bottom: 44.7,12.69 46.1,14.08 44.7,15.48 43.31,14.08
EVENT  (via drill 0.38)
  Top 0.178: IC1.25 24.11,26 23.75,25.64 23.66,25.28 22.71,24.25 22.27,24.24 21.76,23.73 20.83,23.73 20.7,23.61 19.56,23.61 19.43,23.73 18.03,23.73 17.27,24.5 v17.12,24.64 | U$11.P$1 17.27,35.29 v17.78,34.78
  Route2 0.178: v17.78,34.78 17.78,25.64 v17.12,24.64
GND  (via drill 0.38)
  Top 0.178: v25.78,26.53 26.92,26.53 27.75,27.35 v28.7,29.45 | R4.P$1 R3.P$1 20.83,28.04 U$7.P$3 20.46,28.29 v19.98,28.54 19.66,28.41 U$8.P$3
  Top 0.203: IC1.47
  Top 0.254: IC1.18 26.3,29.18 27.56,27.93 27.56,27.54 27.75,27.35 IC1.EXP 31.75,26.53 IC1.47 | C2.P$2 33.4,25.13 33.15,25.14 IC1.47 | C1.P$1 v33.78,21.19
  Top 0.406: J1.4 14.3,29.66 v14.99,30.34
  Route3 0.406: v33.78,21.19 32.77,22.97 32.13,23.61 26.04,23.61 26.04,26.27 v25.78,26.53 25.15,27.16 22.23,27.16 22.23,28.94 21.59,29.83 | v14.99,30.34 15.62,30.34 16.26,30.72 17.86,30.72 18.07,30.93 19.25,30.93 19.48,30.7 20.72,30.7 21.59,29.83 | v19.98,28.54 21.59,29.83
I2C_SCL
  Top 0.178: R1.P$2 20.45,33.51 20.32,33.64 13.59,33.64 13.21,33.39 8,33.39 7.49,32.88 7.49,23.61 7.75,23.35 8.89,23.35 9.19,23.66 J1.1
I2C_SDA
  Top 0.178: R2.P$2 19.94,31.74 19.3,32.37 18.16,32.37 17.4,31.61 17.4,27.8 16.76,27.16 16.76,25.51 16.26,25 15.37,25 15.24,25.13 15.24,25.26 14.86,25.64 11.99,25.64 J1.2
N$1  (via drill 0.38)
  other vias: 12.57,20.69
N$3
  Top 0.254: IC1.48 33.12,26 33.27,26.15 34.8,26.15 35.25,25.7 C2.P$1
N$71Z1Z1O1K1
  Top 0.178: R1.P$1 22.48,33.51 23.24,32.75 23.24,32.12 25.15,30.21 25.95,30.21 IC1.17
N$72Z1Z1O1K1
  Top 0.178: IC1.22 24.83,27.77 24.06,28.54 23.39,29.3 22.48,29.7 21.75,30.43 R2.P$1
ROW1  (via drill 0.38)
  Top 0.178: IC1.16 26.98,29.9 26.42,30.47 26.42,31.99 25.91,32.5 24.51,32.5 24.13,32.88 24.13,50.28 v23.24,51.17
  Bottom 0.178: U$36.P$1 23.24,51.55 22.35,51.55 21.84,52.06 20.95,51.17 20.19,51.17 20.07,51.04 | v23.24,51.17 23.62,51.17 24.51,52.06 24.64,52.06 25.53,51.17 26.29,51.17 26.42,51.04
  pour Bottom: 20.19,50.4 21.59,51.8 19.94,53.45 18.54,52.06
  pour Bottom: 23.24,50.66 24.64,52.06 23.24,53.45 21.84,52.06
  pour Bottom: 26.29,50.4 27.94,52.06 26.54,53.45 24.89,51.8
ROW2  (via drill 0.38)
  Top 0.178: IC1.12 29.11,31 29.84,31.74 29.84,43.55 28.96,44.44 28.96,46.98 v29.84,47.86
  Bottom 0.178: v29.84,47.86 29.84,47.99 29.59,47.99 28.83,48.75 27.18,48.75 26.8,48.37 26.42,48.75 23.49,48.75 23.24,48.5 22.99,48.75 20.32,48.75 20.07,48.5 19.81,48.75 17.02,48.75 16.76,48.5
  pour Bottom: 16.64,47.36 18.03,48.75 16.64,50.15 15.24,48.75
  pour Bottom: 19.94,47.36 21.34,48.75 19.94,50.15 18.54,48.75
  pour Bottom: 23.24,47.36 24.64,48.75 23.24,50.15 21.84,48.75
  pour Bottom: 26.54,47.36 27.94,48.75 26.54,50.15 25.15,48.75
  pour Bottom: 29.84,47.36 31.24,48.75 29.84,50.15 28.45,48.75
ROW3  (via drill 0.38)
  Top 0.178: IC1.11 30.35,31.48 30.35,45.45 v29.84,45.96
  Bottom 0.178: U$33.P$1 29.84,44.69 29.59,44.69 28.83,45.45 26.8,45.45 26.54,45.2 26.29,45.45 23.49,45.45 23.24,45.2 22.99,45.45 20.07,45.45 19.94,45.32 19.81,45.45 16.89,45.45 16.76,45.32 16.64,45.45 13.72,45.45 13.46,45.2 13.21,45.32 10.92,45.32 10.54,45.07 | v29.84,45.96 30.23,44.56 31.11,45.45 33.02,45.45 33.15,45.32 35.94,45.32 36.32,45.07
  pour Bottom: 10.03,44.05 11.43,45.45 10.03,46.85 8.64,45.45
  pour Bottom: 13.34,44.05 14.73,45.45 13.34,46.85 11.94,45.45
  pour Bottom: 16.64,44.05 18.03,45.45 16.64,46.85 15.24,45.45
  pour Bottom: 19.94,44.05 21.34,45.45 19.94,46.85 18.54,45.45
  pour Bottom: 23.24,44.05 24.64,45.45 23.24,46.85 21.84,45.45
  pour Bottom: 26.54,44.05 27.94,45.45 26.54,46.85 25.15,45.45
  pour Bottom: 29.84,44.05 31.24,45.45 29.84,46.85 28.45,45.45
  pour Bottom: 33.15,44.05 34.54,45.45 33.15,46.85 31.75,45.45
  pour Bottom: 36.45,44.05 37.85,45.45 36.45,46.85 35.05,45.45
ROW4  (via drill 0.38)
  Top 0.178: 29.83,30.24 29.87,30.24 | IC1.10 29.83,30.24 | 29.83,30.24 30.36,30.77 30.36,30.87 30.75,31.26 30.75,40.01 32.13,41.39 v33.15,41.39
  Bottom 0.178: v33.15,41.39 33.4,41.39 34.16,42.15 36.07,42.15 36.32,41.9 36.58,42.15 39.5,42.15 39.75,41.9 40,42.15 41.78,42.15 42.29,41.64 | U$32.P$1 30.23,42.15 29.97,41.9 29.84,41.9 29.59,42.15 26.8,42.15 26.54,41.9 26.42,41.9 26.16,42.15 23.62,42.15 23.24,41.77 22.86,42.15 20.32,42.15 20.07,41.9 19.81,42.15 17.02,42.15 16.76,41.9 16.51,42.15 13.72,42.15 13.46,41.9 13.21,42.15 10.29,42.15 10.03,41.9 9.78,42.15 7.11,42.15 6.86,41.9 6.6,42.15 4.7,42.15 4.45,41.9
  pour Bottom: 3.43,40.75 4.83,42.15 3.43,43.55 2.03,42.15
  pour Bottom: 6.73,40.75 8.13,42.15 6.73,43.55 4.95,42.53
  pour Bottom: 10.03,40.75 11.43,42.15 10.03,43.55 8.64,42.15
  pour Bottom: 13.34,40.75 14.73,42.15 13.34,43.55 11.94,42.15
  pour Bottom: 16.64,40.75 18.03,42.15 16.64,43.55 15.24,42.15
  pour Bottom: 19.94,40.75 21.34,42.15 19.94,43.55 18.54,42.15
  pour Bottom: 23.24,40.75 24.64,42.15 23.24,43.55 21.84,42.15
  pour Bottom: 26.54,40.75 27.94,42.15 26.54,43.55 25.15,42.15
  pour Bottom: 29.84,40.75 31.24,42.15 29.84,43.55 28.45,42.15
  pour Bottom: 33.15,40.75 34.54,42.15 33.15,43.55 31.75,42.15
  pour Bottom: 36.45,40.75 37.85,42.15 36.45,43.55 35.05,42.15
  pour Bottom: 39.75,40.75 41.53,42.53 39.75,43.55 38.35,42.15
  pour Bottom: 43.05,40.75 44.45,42.15 43.05,43.55 41.66,42.15
ROW5  (via drill 0.38)
  Top 0.178: IC1.9 30.17,29.9 30.76,30.49 30.76,30.62 31.13,30.99 31.13,31.75 32.26,32.88 32.26,37.07 v33.15,37.96
  Bottom 0.178: v33.15,37.96 33.15,38.09 33.4,38.09 34.16,38.85 36.2,38.85 36.45,38.59 36.45,38.72 36.58,38.85 39.5,38.85 39.75,38.59 40,38.85 42.67,38.85 42.93,38.59 43.18,38.85 45.72,38.85 45.85,38.72 | U$31.P$1 32.39,38.59 32.13,38.85 30.35,38.85 30.1,38.59 29.84,38.85 26.92,38.85 26.67,38.59 26.42,38.85 23.62,38.85 23.37,38.59 23.11,38.85 20.19,38.85 19.94,38.59 19.69,38.85 17.02,38.85 16.76,38.59 16.51,38.85 13.72,38.85 13.46,38.59 13.19,39.24 10.4,39.24 10.16,38.59 9.91,38.85 7.11,38.85 6.86,38.59 6.6,38.85 3.68,38.85 3.43,38.59 3.17,38.85 0.76,38.85 0.51,38.59
  pour Bottom: 3.43,37.45 4.83,38.85 3.43,40.24 2.03,38.85
  pour Bottom: 0.13,37.45 1.52,38.85 0.13,40.24 -1.27,38.85
  pour Bottom: 6.73,37.45 8.13,38.85 6.73,40.24 5.33,38.85
  pour Bottom: 10.03,37.45 11.43,38.85 10.03,40.24 8.64,38.85
  pour Bottom: 13.34,37.45 14.73,38.85 13.34,40.24 11.94,38.85
  pour Bottom: 16.64,37.45 18.03,38.85 16.64,40.24 15.24,38.85
  pour Bottom: 19.94,37.45 21.34,38.85 19.94,40.24 18.54,38.85
  pour Bottom: 23.24,37.45 24.64,38.85 23.24,40.24 21.84,38.85
  pour Bottom: 26.54,37.45 27.94,38.85 26.54,40.24 25.15,38.85
  pour Bottom: 29.84,37.45 31.24,38.85 29.84,40.24 28.45,38.85
  pour Bottom: 33.15,37.45 34.54,38.85 33.15,40.24 31.75,38.85
  pour Bottom: 36.45,37.45 37.85,38.85 36.45,40.24 35.05,38.85
  pour Bottom: 39.75,37.45 41.15,38.85 39.75,40.24 38.35,38.85
  pour Bottom: 43.05,37.45 44.45,38.85 43.05,40.24 41.66,38.85
  pour Bottom: 46.36,37.45 47.75,38.85 46.36,40.24 44.96,38.85
ROW6  (via drill 0.38)
  Top 0.178: IC1.8 30.56,29.53 31.62,30.59 32.18,30.64 32.64,31.1 32.64,32.37 33.15,32.88 v33.15,34.66
  Bottom 0.178: U$30.P$1 33.02,34.91 32.64,34.91 32,35.55 30.23,35.55 29.97,35.29 29.72,35.55 26.92,35.55 26.67,35.29 26.42,35.55 23.49,35.55 23.24,35.29 22.99,35.55 20.19,35.55 19.94,35.29 19.69,35.55 16.89,35.55 16.64,35.29 16.38,35.55 13.72,35.55 13.59,35.42 13.46,35.55 10.41,35.55 10.16,35.29 9.91,35.55 7.11,35.55 6.98,35.42 6.86,35.55 3.68,35.55 3.43,35.29 3.17,35.55 0.63,35.55 0.38,35.29 | v33.15,34.66 33.4,34.66 34.29,35.55 36.07,35.55 36.45,35.16 36.83,35.55 39.37,35.55 39.62,35.29 39.88,35.55 42.8,35.55 43.05,35.29 43.31,35.55 45.85,35.55 46.1,35.29
  pour Bottom: 0.13,34.15 1.52,35.55 0.13,36.94 -1.27,35.55
  pour Bottom: 3.43,34.15 4.83,35.55 3.43,36.94 2.03,35.55
  pour Bottom: 6.73,34.15 8.13,35.55 6.73,36.94 5.33,35.55
  pour Bottom: 10.03,34.15 11.43,35.55 10.03,36.94 8.64,35.55
  pour Bottom: 13.34,34.15 14.73,35.55 13.34,36.94 11.94,35.55
  pour Bottom: 16.64,34.15 18.03,35.55 16.64,36.94 15.24,35.55
  pour Bottom: 19.94,34.15 21.34,35.55 19.94,36.94 18.54,35.55
  pour Bottom: 23.24,34.15 24.64,35.55 23.24,36.94 21.84,35.55
  pour Bottom: 26.54,34.15 27.94,35.55 26.54,36.94 25.15,35.55
  pour Bottom: 29.84,34.15 31.24,35.55 29.84,36.94 28.45,35.55
  pour Bottom: 33.15,34.15 34.54,35.55 33.15,36.94 31.75,35.55
  pour Bottom: 36.45,34.15 37.85,35.55 36.45,36.94 35.05,35.55
  pour Bottom: 39.75,34.15 41.15,35.55 39.75,36.94 38.35,35.55
  pour Bottom: 43.05,34.15 44.45,35.55 43.05,36.94 41.66,35.55
  pour Bottom: 46.36,34.15 47.75,35.55 46.36,36.94 44.96,35.55
ROW7  (via drill 0.38)
  Top 0.178: IC1.7 30.87,29.21 31.88,30.21 32.44,30.27 33.02,30.85 v33.66,31.99
  Route2 0.178: v14.1,32.24 v6.86,32.24
  Bottom 0.178: v33.66,31.99 34.04,31.99 34.04,32.24 36.2,32.24 36.45,31.99 36.7,32.24 39.37,32.24 39.62,31.99 39.88,32.24 42.67,32.24 43.05,31.86 43.05,31.99 43.31,32.24 45.72,32.24 45.97,31.99 | U$29.P$1 32.26,31.99 32,32.24 30.23,32.24 29.97,31.99 29.72,32.5 26.8,32.5 26.54,31.99 26.29,32.24 23.62,32.24 23.37,31.99 23.11,32.24 20.83,32.24 20.57,31.99 19.18,31.99 18.92,32.24 16.89,32.24 16.76,32.12 16.64,32.24 v14.1,32.24 13.72,32.24 13.46,31.99 13.21,32.24 | 10.29,32.24 10.03,31.99 9.78,32.24 7.11,32.24 6.86,31.99 6.6,32.24 3.81,32.24 3.56,31.99 3.3,32.24 0.51,32.24 0.38,32.12
  pour Bottom: 0.13,30.85 1.52,32.24 0.13,33.64 -1.27,32.24
  pour Bottom: 3.43,30.85 4.83,32.24 3.43,33.64 2.03,32.24
  pour Bottom: 6.73,30.85 8.13,32.24 6.73,33.64 5.33,32.24
  pour Bottom: 10.03,30.85 11.43,32.24 10.03,33.64 8.64,32.24
  pour Bottom: 13.34,30.85 14.73,32.24 13.34,33.64 11.94,32.24
  pour Bottom: 16.64,30.85 18.03,32.24 16.64,33.64 15.24,32.24
  pour Bottom: 19.94,30.85 21.34,32.24 19.94,33.64 18.54,32.24
  pour Bottom: 23.24,30.85 24.64,32.24 23.24,33.64 21.84,32.24
  pour Bottom: 26.54,30.85 27.94,32.24 26.54,33.64 25.15,32.24
  pour Bottom: 29.84,30.85 31.24,32.24 29.84,33.64 28.45,32.24
  pour Bottom: 33.15,30.85 34.54,32.24 33.15,33.64 31.75,32.24
  pour Bottom: 36.45,30.85 37.85,32.24 36.45,33.64 35.05,32.24
  pour Bottom: 39.75,30.85 41.15,32.24 39.75,33.64 38.35,32.24
  pour Bottom: 43.05,30.85 44.45,32.24 43.05,33.64 41.66,32.24
  pour Bottom: 46.36,30.85 47.75,32.24 46.36,33.64 44.96,32.24
ROW8  (via drill 0.38)
  Top 0.178: IC1.2 33.15,27.93 33.66,27.93 34.54,28.81 v35.56,28.94
  Route2 0.178: v6.86,28.94 v15.75,28.94
  Route3 0.178: v19.05,29.07 18.8,29.07 18.67,28.94 v15.75,28.94 | v23.11,28.56 35.18,28.56 v35.56,28.94
  Bottom 0.178: v35.56,28.94 39.5,28.94 39.75,29.2 40,28.94 42.8,28.94 43.05,29.2 43.31,28.94 45.85,28.94 46.1,29.2 | U$24.P$1 35.31,29.07 35.18,28.94 33.4,28.94 33.15,29.2 33.15,27.54 29.84,27.54 29.84,29.2 29.59,28.94 | v23.11,28.56 23.24,27.54 26.54,27.54 26.54,28.94 | 23.24,28.69 22.99,28.94 20.57,28.94 19.94,29.32 19.43,28.94 | 17.02,28.94 16.76,28.69 16.51,28.94 v15.75,28.94 13.72,28.94 13.34,28.56 12.95,28.94 | 10.29,28.94 10.03,28.69 9.78,28.94 6.98,28.94 6.73,28.69 6.48,28.94 3.81,28.94 3.56,28.69 3.3,28.94 0.63,28.94 0.38,28.69
  pour Bottom: 0.13,27.54 1.52,28.94 0.13,30.34 -1.27,28.94
  pour Bottom: 3.43,27.54 4.83,28.94 3.43,30.34 2.03,28.94
  pour Bottom: 6.73,27.54 8.13,28.94 6.73,30.34 5.33,28.94
  pour Bottom: 10.03,27.54 11.43,28.94 10.03,30.34 8.64,28.94
  pour Bottom: 13.34,27.54 14.73,28.94 13.34,30.34 11.94,28.94
  pour Bottom: 16.64,27.54 18.03,28.94 16.64,30.34 15.24,28.94
  pour Bottom: 19.94,27.54 21.34,28.94 19.94,30.34 18.54,28.94
  pour Bottom: 23.24,27.54 24.64,28.94 23.24,30.34 21.84,28.94
  pour Bottom: 26.54,27.54 27.94,28.94 26.54,30.34 25.15,28.94
  pour Bottom: 29.84,27.54 31.24,28.94 29.84,30.34 28.45,28.94
  pour Bottom: 33.15,27.54 34.54,28.94 33.15,30.34 31.75,28.94
  pour Bottom: 36.45,27.54 37.85,28.94 36.45,30.34 35.05,28.94
  pour Bottom: 39.75,27.54 41.15,28.94 39.75,30.34 38.35,28.94
  pour Bottom: 43.05,27.54 44.45,28.94 43.05,30.34 41.66,28.94
  pour Bottom: 46.36,27.54 47.75,28.94 46.36,30.34 44.96,28.94
ROW9  (via drill 0.38)
  Top 0.178: IC1.46 32.29,25.23 33.15,24.37 36.07,24.37 v36.45,24.75
  Route2 0.178: v6.86,25.64 15.62,25.64 v15.75,25.77
  Route3 0.178: v22.99,25.77 v15.75,25.77
  Bottom 0.178: U$23.P$1 36.45,25 36.07,25 35.43,25.64 33.4,25.64 33.15,25.39 33.53,26.53 33.02,27.16 29.97,27.16 29.34,26.53 29.84,24.24 26.54,24.24 26.92,26.15 26.16,27.16 23.49,27.16 23.11,26.78 23.11,25.64 | v36.45,24.75 36.45,24.88 37.21,25.64 39.37,25.64 39.75,25.26 40.13,25.64 42.8,25.64 43.05,25.39 43.31,25.64 45.72,25.64 46.1,25.26 | 20.19,25.64 19.94,25.89 19.69,25.64 17.53,25.64 17.27,25.89 16.38,25.89 16.26,25.64 v15.75,25.77 15.49,25.77 15.37,25.64 13.72,25.64 13.46,25.89 13.21,25.64 | 10.29,25.64 10.03,25.89 9.78,25.64 6.98,25.64 6.73,25.89 6.48,25.64 3.68,25.64 3.43,25.89 3.17,25.64 0.51,25.64 0.25,25.89
  pour Bottom: 0.13,24.24 1.52,25.64 0.13,27.04 -1.27,25.64
  pour Bottom: 3.43,24.24 4.83,25.64 3.43,27.04 2.03,25.64
  pour Bottom: 6.73,24.24 8.13,25.64 6.73,27.04 5.33,25.64
  pour Bottom: 10.03,24.24 11.43,25.64 10.03,27.04 8.64,25.64
  pour Bottom: 13.34,24.24 14.73,25.64 13.34,27.04 11.94,25.64
  pour Bottom: 16.64,24.24 18.03,25.64 16.64,27.04 15.24,25.64
  pour Bottom: 19.94,24.24 21.34,25.64 19.94,27.04 18.54,25.64
  pour Bottom: 23.24,24.24 24.64,25.64 23.24,27.04 21.84,25.64
  pour Bottom: 26.54,24.24 27.94,25.64 26.54,27.04 25.15,25.64
  pour Bottom: 29.84,24.24 31.24,25.64 29.84,27.04 28.45,25.64
  pour Bottom: 33.15,24.24 34.54,25.64 33.15,27.04 31.75,25.64
  pour Bottom: 36.45,24.24 37.85,25.64 36.45,27.04 35.05,25.64
  pour Bottom: 39.75,24.24 41.15,25.64 39.75,27.04 38.35,25.64
  pour Bottom: 43.05,24.24 44.45,25.64 43.05,27.04 41.66,25.64
  pour Bottom: 46.36,24.24 47.75,25.64 46.36,27.04 44.96,25.64
ROW10  (via drill 0.38)  (2 unrouted)
  Top 0.178: IC1.34 27.28,22.82 U$14.P$1 v26.38,21.63
  Route2 0.178: v6.86,21.7 7.49,22.34 12.57,22.34 v13.34,21.58
  Route3 0.178: v19.94,22.59 20.95,21.58 26.32,21.58 v26.37,21.63 | v23.24,21.45 23.24,21.53 23.28,21.57
  Bottom 0.178: U$14.P$1 26.54,21.83 26.54,23.73 26.67,23.86 29.67,23.87 30.1,23.48 30.1,22.34 30.48,22.34 30.88,22.11 32.26,21.96 32.64,22.34 36.07,22.34 36.32,22.08 36.58,22.34 39.5,22.34 39.75,22.08 40,22.34 42.67,22.34 42.93,22.08 43.18,22.34 45.72,22.34 45.85,22.21 | v26.38,21.63 25.98,21.63 25.27,22.34 | 23.62,22.34 23.37,22.08 23.11,22.34 | 20.32,22.34 20.07,22.08 16.64,22.08 16.38,22.34 13.72,22.34 13.46,22.08 13.21,22.34 | 10.29,22.34 10.03,22.08 9.78,22.34 7.24,22.34 6.98,22.08 6.73,22.34 3.81,22.34 3.56,22.08 3.3,22.34 0.63,22.34 0.38,22.08
  pour Bottom: 0.13,20.94 1.52,22.34 0.13,23.73 -1.27,22.34
  pour Bottom: 3.43,20.94 4.83,22.34 3.43,23.73 2.03,22.34
  pour Bottom: 6.73,20.94 8.13,22.34 6.73,23.73 5.33,22.34
  pour Bottom: 10.03,20.94 11.43,22.34 10.03,23.73 8.64,22.34
  pour Bottom: 13.34,20.94 14.73,22.34 13.34,23.73 11.94,22.34
  pour Bottom: 16.64,20.94 18.03,22.34 16.64,23.73 15.24,22.34
  pour Bottom: 19.94,20.94 21.34,22.34 19.94,23.73 18.54,22.34
  pour Bottom: 23.24,20.94 24.64,22.34 23.24,23.73 21.84,22.34
  pour Bottom: 26.54,20.94 27.94,22.34 26.54,23.73 25.15,22.34
  pour Bottom: 29.84,20.94 31.24,22.34 29.84,23.73 28.45,22.34
  pour Bottom: 33.15,20.94 34.54,22.34 33.15,23.73 31.75,22.34
  pour Bottom: 36.45,20.94 37.85,22.34 36.45,23.73 35.05,22.34
  pour Bottom: 39.75,20.94 41.15,22.34 39.75,23.73 38.35,22.34
  pour Bottom: 43.05,20.94 44.45,22.34 43.05,23.73 41.66,22.34
  pour Bottom: 46.36,20.94 47.75,22.34 46.36,23.73 44.96,22.34
ROW11  (via drill 0.38)
  Top 0.178: IC1.35 27.05,21.84 27.05,21.32 26.67,20.94 26.04,20.94 25.65,20.56 v25.65,19.04
  Route2 0.178: v14.1,18.91 13.59,19.42 10.92,19.42 v10.16,18.65
  Bottom 0.178: U$15.P$1 26.54,19.8 27.05,19.8 27.81,19.04 27.87,19.04 28.19,18.71 29.74,18.71 29.97,19.04 32.89,19.04 33.15,19.29 33.4,19.04 36.2,19.04 36.45,19.29 36.7,19.04 38.48,19.04 38.61,19.16 38.86,19.16 38.99,19.04 42.55,19.04 42.93,19.42 43.31,19.04 45.59,19.04 45.85,19.29 | v25.65,19.04 23.49,19.04 23.24,19.29 22.99,19.04 20.07,19.04 19.81,19.29 19.56,19.04 16.89,19.04 16.64,19.29 16.38,19.04 13.46,19.04 13.21,19.29 12.95,19.04 12.32,19.04 12.06,19.29 | 11.3,19.29 11.05,19.04 9.27,19.04 9.02,19.29 7.75,19.29 7.49,19.04 3.68,19.04 3.43,19.29 3.17,19.04 0.63,19.04 0.38,19.29
  pour Bottom: 0.13,17.64 1.52,19.04 0.13,20.43 -1.27,19.04
  pour Bottom: 3.43,17.64 4.83,19.04 3.43,20.43 2.03,19.04
  pour Bottom: 6.73,17.64 8.13,19.04 6.73,20.43 5.33,19.04
  pour Bottom: 10.03,17.64 11.43,19.04 10.03,20.43 8.64,19.04
  pour Bottom: 13.34,17.64 14.73,19.04 13.34,20.43 11.94,19.04
  pour Bottom: 16.64,17.64 18.03,19.04 16.64,20.43 15.24,19.04
  pour Bottom: 19.94,17.64 21.34,19.04 19.94,20.43 18.54,19.04
  pour Bottom: 23.24,17.64 24.64,19.04 23.24,20.43 21.84,19.04
  pour Bottom: 26.54,17.64 27.94,19.04 26.54,20.43 25.15,19.04
  pour Bottom: 29.84,17.64 31.24,19.04 29.84,20.43 28.45,19.04
  pour Bottom: 33.15,17.64 34.54,19.04 33.15,20.43 31.75,19.04
  pour Bottom: 36.45,17.64 37.85,19.04 36.45,20.43 35.05,19.04
  pour Bottom: 39.75,17.64 41.15,19.04 39.75,20.43 38.35,19.04
  pour Bottom: 43.05,17.64 44.45,19.04 43.05,20.43 41.66,19.04
  pour Bottom: 46.36,17.64 47.75,19.04 46.36,20.43 44.96,19.04
ROW12  (via drill 0.38)
  Top 0.178: 26.67,16.75 v26.54,16.62 26.29,16.88 26.29,20.43 26.42,20.56 26.8,20.56 27.43,21.19 27.43,21.45 28.05,22.06 IC1.36
  Bottom 0.178: v26.54,16.62 26.8,16.62 27.69,15.73 29.59,15.73 29.84,15.99 30.1,15.73 32.89,15.73 33.15,15.99 33.4,15.73 36.2,15.73 36.45,15.99 36.7,15.73 39.5,15.73 39.75,15.99 40,15.73 42.8,15.73 43.05,15.99 43.31,15.73 45.72,15.73 45.97,15.99 | U$16.P$1 25.53,15.86 25.4,15.73 23.62,15.73 23.37,15.99 23.11,15.73 20.19,15.73 20.07,15.86 19.94,15.86 19.81,15.73 16.89,15.73 16.64,15.99 16.38,15.73 13.59,15.73 13.34,15.99 13.08,15.73 10.16,15.73 10.03,15.86 9.91,15.86 9.78,15.73 6.98,15.73 6.73,15.99 6.48,15.73 3.68,15.73 3.43,15.99 3.17,15.73 0.63,15.73 0.38,15.99
  pour Bottom: 0.13,14.34 1.52,15.73 0.13,17.13 -1.27,15.73
  pour Bottom: 3.43,14.34 4.83,15.73 3.43,17.13 2.03,15.73
  pour Bottom: 6.73,14.34 8.13,15.73 6.73,17.13 5.33,15.73
  pour Bottom: 10.03,14.34 11.43,15.73 10.03,17.13 8.64,15.73
  pour Bottom: 13.34,14.34 14.73,15.73 13.34,17.13 11.94,15.73
  pour Bottom: 16.64,14.34 18.03,15.73 16.64,17.13 15.24,15.73
  pour Bottom: 19.94,14.34 21.34,15.73 19.94,17.13 18.54,15.73
  pour Bottom: 23.24,14.34 24.64,15.73 23.24,17.13 21.84,15.73
  pour Bottom: 26.54,14.34 27.94,15.73 26.54,17.13 25.15,15.73
  pour Bottom: 29.84,14.34 31.24,15.73 29.84,17.13 28.45,15.73
  pour Bottom: 33.15,14.34 34.54,15.73 33.15,17.13 31.75,15.73
  pour Bottom: 36.45,14.34 37.85,15.73 36.45,17.13 35.05,15.73
  pour Bottom: 39.75,14.34 41.15,15.73 39.75,17.13 38.35,15.73
  pour Bottom: 43.05,14.34 44.45,15.73 43.05,17.13 41.66,15.73
  pour Bottom: 46.36,14.34 47.75,15.73 46.36,17.13 44.96,15.73
ROW13  (via drill 0.38)
  Top 0.178: IC1.37 29.11,22.06 29.46,21.7 28.96,21.19 27.94,21.19 26.67,19.92 26.67,17.77 27.3,17.13 27.3,14.08 v26.8,13.07
  Bottom 0.178: U$17.P$1 26.54,12.81 25.78,12.81 25.4,12.43 23.49,12.43 23.24,12.69 22.99,12.43 20.32,12.43 20.07,12.69 19.81,12.43 16.89,12.43 16.76,12.56 16.64,12.43 13.46,12.43 13.34,12.56 13.21,12.43 10.41,12.43 10.29,12.56 10.16,12.43 6.98,12.43 6.86,12.56 6.73,12.43 3.68,12.43 3.56,12.56 3.43,12.43 1.52,12.43 1.02,12.94 | v26.8,13.07 27.43,12.43 29.59,12.43 29.84,12.69 30.1,12.43 32.77,12.43 33.02,12.69 33.27,12.43 36.07,12.43 36.45,12.81 36.83,12.43 39.62,12.43 39.75,12.56 39.88,12.56 40,12.43 42.8,12.43 42.93,12.56 43.05,12.56 43.18,12.43 44.96,12.43 45.21,12.69
  pour Bottom: 0.13,11.03 1.52,12.43 0.13,13.83 -1.27,12.43
  pour Bottom: 3.43,11.03 4.83,12.43 3.43,13.83 2.03,12.43
  pour Bottom: 6.73,11.03 8.13,12.43 6.73,13.83 5.33,12.43
  pour Bottom: 10.03,11.03 11.43,12.43 10.03,13.83 8.64,12.43
  pour Bottom: 13.34,11.03 14.73,12.43 13.34,13.83 11.94,12.43
  pour Bottom: 16.64,11.03 18.03,12.43 16.64,13.83 15.24,12.43
  pour Bottom: 19.94,11.03 21.34,12.43 19.94,13.83 18.54,12.43
  pour Bottom: 23.24,11.03 24.64,12.43 23.24,13.83 21.84,12.43
  pour Bottom: 26.54,11.03 27.94,12.43 26.54,13.83 25.15,12.43
  pour Bottom: 29.84,11.03 31.24,12.43 29.84,13.83 28.45,12.43
  pour Bottom: 33.15,11.03 34.54,12.43 33.15,13.83 31.75,12.43
  pour Bottom: 36.45,11.03 37.85,12.43 36.45,13.83 35.05,12.43
  pour Bottom: 39.75,11.03 41.15,12.43 39.75,13.83 38.35,12.43
  pour Bottom: 43.05,11.03 44.45,12.43 43.05,13.83 41.66,12.43
  pour Bottom: 46.36,11.03 47.75,12.43 46.36,13.83 44.96,12.43
ROW14  (via drill 0.38)
  Top 0.178: IC1.38 29.84,22.08 29.84,21.58 29.08,20.81 28.07,20.81 27.05,19.8 27.05,17.89 27.69,17.26 27.69,12.94 26.8,12.05 v26.8,9.76
  Bottom 0.178: U$18.P$1 26.54,9.38 25.65,9.38 25.4,9.13 23.49,9.13 23.24,9.38 22.99,9.13 20.07,9.13 19.94,9.26 19.81,9.13 16.89,9.13 16.64,9.38 16.38,9.13 13.59,9.13 13.34,9.38 13.08,9.13 10.41,9.13 10.16,9.38 8.36,9.44 7.24,9.38 6.86,9.51 | 26.67,10.02 v26.8,9.76 27.56,9.13 29.72,9.13 29.84,9.26 29.97,9.13 33.02,9.13 33.15,9.26 33.27,9.13 36.2,9.13 36.45,9.26 36.58,9.38 38.1,9.46 39.37,9.38
  pour Bottom: 6.73,7.73 8.13,9.13 6.73,10.53 5.33,9.13
  pour Bottom: 10.03,7.73 11.43,9.13 10.03,10.53 8.64,9.13
  pour Bottom: 13.34,7.73 14.73,9.13 13.34,10.53 11.94,9.13
  pour Bottom: 16.64,7.73 18.03,9.13 16.64,10.53 15.24,9.13
  pour Bottom: 19.94,7.73 21.34,9.13 19.94,10.53 18.54,9.13
  pour Bottom: 23.24,7.73 24.64,9.13 23.24,10.53 21.84,9.13
  pour Bottom: 26.54,7.73 27.94,9.13 26.54,10.53 25.15,9.13
  pour Bottom: 29.84,7.73 31.24,9.13 29.84,10.53 28.45,9.13
  pour Bottom: 33.15,7.73 34.54,9.13 33.15,10.53 31.75,9.13
  pour Bottom: 36.45,7.73 37.85,9.13 36.45,10.53 35.05,9.13
  pour Bottom: 39.75,7.73 41.15,9.13 39.75,10.53 38.35,9.13
ROW15  (via drill 0.38)
  Top 0.178: IC1.39 29.81,22.75 30.23,22.34 30.23,21.45 29.21,20.43 28.19,20.43 27.43,19.67 27.43,18.02 28.07,17.38 28.07,12.69 27.56,12.18 27.56,8.75 v26.54,6.21
  Bottom 0.178: U$19.P$1 26.54,5.95 25.53,5.95 25.4,5.83 23.62,5.83 23.37,5.57 23.11,5.83 20.32,5.83 20.07,5.57 19.81,5.83 17.02,5.83 16.76,5.57 16.64,5.57 16.38,5.83 13.72,5.83 13.46,5.57 | v26.54,6.21 26.92,6.72 27.81,5.83 29.46,5.83 29.72,5.57 29.84,5.57 30.1,5.83 32.77,5.83 33.02,5.57 33.27,5.83
  pour Bottom: 33.15,4.43 34.54,5.83 33.15,7.22 31.75,5.83
  pour Bottom: 29.84,4.43 31.24,5.83 29.84,7.22 28.45,5.83
  pour Bottom: 26.54,4.43 27.94,5.83 26.54,7.22 25.15,5.83
  pour Bottom: 23.24,4.43 24.64,5.83 23.24,7.22 21.84,5.83
  pour Bottom: 19.94,4.43 21.34,5.83 19.94,7.22 18.54,5.83
  pour Bottom: 16.64,4.43 18.03,5.83 16.64,7.22 15.24,5.83
  pour Bottom: 13.34,4.43 14.73,5.83 13.34,7.22 11.94,5.83
ROW16  (via drill 0.38)
  Top 0.178: IC1.40 30.61,22.72 30.61,21.32 29.34,20.05 28.32,20.05 27.81,19.54 27.81,18.15 28.45,17.51 28.45,12.69 29.34,11.8 29.34,6.21 v26.54,3.41
  Bottom 0.178: v26.54,3.41 26.54,3.29 26.92,3.29 27.69,2.53 27.97,2.59 29.2,3.3 29.59,3.67 29.72,3.8 | U$20.P$1 25.78,2.91 25.4,2.53 23.62,2.53 23.37,2.27 23.11,2.53 20.19,2.53 19.94,2.27 19.69,2.53 18.8,2.65 18.49,2.62 17.31,3.28 16.76,3.67 16.64,3.8
  pour Bottom: 16.64,1.13 18.03,2.53 16.64,3.92 15.24,2.53
  pour Bottom: 19.94,1.13 21.34,2.53 19.94,3.92 18.54,2.53
  pour Bottom: 23.24,1.13 24.64,2.53 23.24,3.92 21.84,2.53
  pour Bottom: 26.54,1.13 27.94,2.53 26.54,3.92 25.15,2.53
  pour Bottom: 29.84,1.13 31.24,2.53 29.84,3.92 28.45,2.53
VCC  (via drill 0.38)
  Top 0.178: U$7.P$1 20.32,24.75 v20.06,24.71 19.81,24.75 U$8.P$1
  Top 0.203: IC1.41 30.54,23.5
  Top 0.254: IC1.21 24.26,29.07 v24.26,29.7 | 30.54,23.5 30.54,23.48 31.02,22.99 31.02,21.92 31.5,21.45 | 31.5,21.45 31.88,21.07 32.64,21.07 32.89,21.32 32.89,22.06 C1.P$2 | v31.31,21.34 31.39,21.34 31.5,21.45
  Top 0.61: v24.26,29.7 24.26,30.21 22.61,31.86 22.61,32.37 22.35,32.62 v20.19,32.62 20.07,32.62 19.69,33.01 17.65,33.01 16.64,31.99 16.64,28.43 16.13,27.93 15.24,27.93 14.99,27.67 11.99,27.67 J1.3
  Route2 0.178: v20.06,24.71 20.07,27.16 20.83,27.93 20.83,28.94 20.07,29.7 20.07,32.5 v20.19,32.62
  Route2 0.406: v24.26,29.7 24.51,29.58 30.61,21.83 v31.31,21.34
XRES  (via drill 0.38)
  Top 0.178: IC1.26 24.18,25.34 24.09,25.09 22.87,23.86 22.41,23.84 21.91,23.34 21.08,23.35 20.95,23.23 19.43,23.23 19.3,23.35 v17.15,23.35 | U$12.P$1 14.19,37.29 15.3,36.43 16.38,36.43 16.89,36.94 v16.89,37.32
  Route2 0.178: 17.15,23.61 v17.15,23.35 16.76,23.73 16.76,23.99 16.38,24.37 16.38,24.88 17.02,25.51 17.02,36.56 v16.89,37.32

### Text on the board
tPlace: RST | EVT | GND | VCC | SDA | SCL | ADR1 | ADR0 | (c) 2020 Augmented Instruments Ltd | rev. B2
tNames: R4 | R3 | C2
tDocu: +